# EasyEDA Pro project 校赛整流逆变一体板.epro

# Schematic buck-boost
Board Name: Board3; Create Date: 2026-04-09; Page Name: P1; Project Name: 校赛整流逆变一体板; Schematic Name: buck-boost; Update Date: 2026-04-09; Company: 嘉立创EDA; Page Size: A4; Version: V1.0
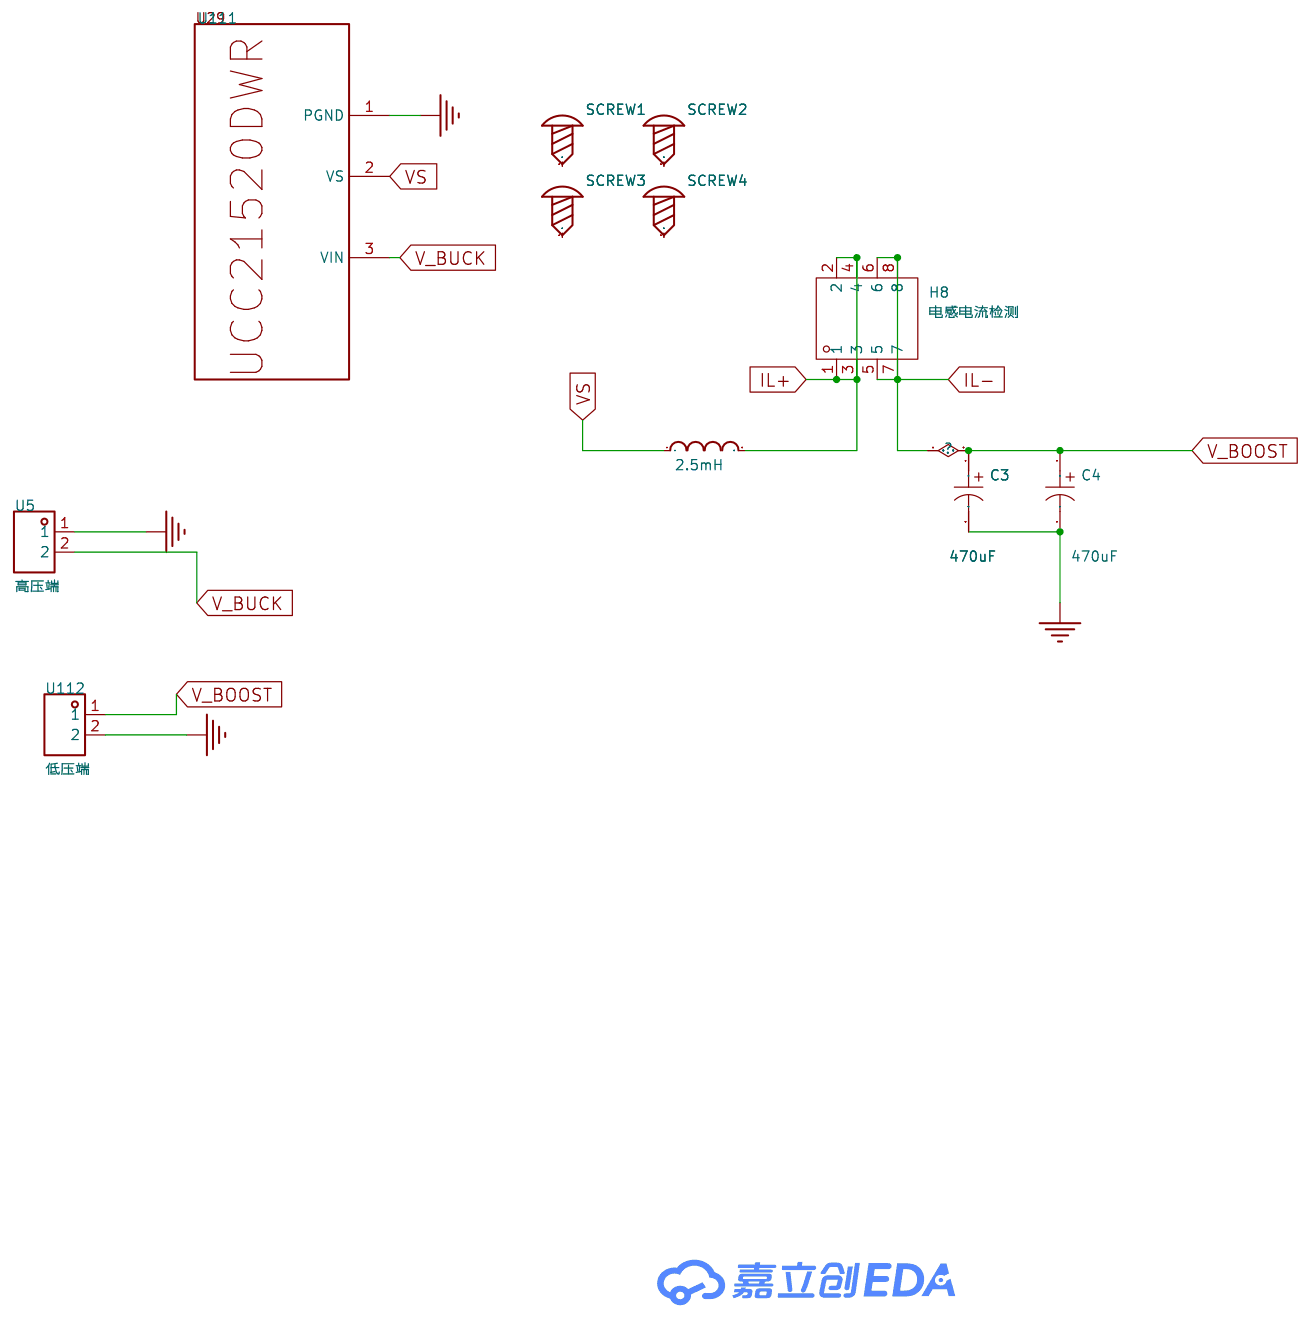
[diagram p0: schematic sheet]

## Parts
C3  470uF  [CAP-TH_BD16.0-P7.50-D0.8-FD]
C4  470uF  [CAP-TH_BD16.0-P7.50-D0.8-FD]
H8  电感电流检测  [HDR-TH_8P-P2.54-V-F-R2-C4-S2.54-1]
L2  2.5mH  [直插环形电感]
SCREW1  -  [M3螺丝]
SCREW2  -  [M3螺丝]
SCREW3  -  [M3螺丝]
SCREW4  -  [M3螺丝]
U5  高压端  [CONN-TH_2P-P7.62_L15.2-W16.7-EX4.2]
U111  -  [ucc隔离半桥]
U112  低压端  [CONN-TH_2P-P7.62_L15.2-W16.7-EX4.2]

## Library data of the parts
C3 C4 = ERG100V470M16X26: 容值:470uF;精度:±20%;额定电压:100V;纹波电流:1.62A@100kHz;; LCSC Part Name: 470uF ±20% 100V; Supplier Part: C49256827; Manufacturer: JIERR(捷而瑞); Supplier Footprint: 插件,D16xL26mm; JLCPCB Part Class: 扩展库; Datasheet: https://item.szlcsc.com/datasheet/ERG100V470M16X26/51692227.html; Supplier: LCSC; Tolerance: ±20%; Voltage Rating: 100V; Ripple Current: 1.62A@100kHz; Pin Spacing: 7.5mm; Diameter: 16mm; Height - Seated (Max): 26mm; Lifetime: 2000hrs@105℃; Operating Temperature: -40℃~+105℃
H8 = HX PM2.54-2x4P ZC: 插孔结构:2x4P;间距:2.54mm;行距:2.54mm;圆孔/方孔:方孔;安装方式:直插;排数:双排;总孔位数:8P;额定电流:3A;额定电压:1kV;插孔方向:顶部;塑高:8.5mm;触头材质:黄铜;触头镀层:金;工作温度:-40℃~+105℃;; LCSC Part Name: 2x4P 间距:2.54mm 直插; Supplier Part: C32713305; Manufacturer: hanxia(韩下); Supplier Footprint: 插件,P=2.54mm; JLCPCB Part Class: 扩展库; Datasheet: https://item.szlcsc.com/datasheet/HX%2520PM2.54-2x4P%2520ZC/34444585.html; Supplier: LCSC; Holes Structure: 2x4P; Pitch: 2.54mm; Row Spacing: 2.54mm; Circular Hole / Square Hole: 方孔; Mounting Type: 直插; Number of Rows: 双排; Number of Positions: 8P; Current Rating: 3A; Voltage Rating (Max): 1kV; Holes Direction: 顶部; Insulation Height: 8.5mm; Contact Material: 黄铜; Contact Plating: 金; Operating Temperature: -40℃~+105℃; PIN Length: 3.2mm
L2 = 直插环形电感
SCREW1-SCREW4 = M3螺丝: Supplier Footprint: 插件
U5 U112 = DBT50G-7.62-2P-BK-P: 隔板类型:带盖板;间距:7.62mm;结构:1x2P;安装方式:直针;引脚位置:边脚;排数:1;额定电流:20A;额定电压:300V;线规 - AWG:12~22;线规 - 平方毫米:-;工作温度范围:-40℃~+105℃;颜色:黑色;每排PIN数:2;; LCSC Part Name: 7.62mm 1x2P 每排P数:2 排数:1 直针 边脚; Supplier Part: C496127; Manufacturer: DORABO(地博电气); Supplier Footprint: 插件,P=7.62mm; JLCPCB Part Class: 扩展库; Datasheet: https://atta.szlcsc.com/upload/public/pdf/source/20230321/5EF6A0D07A73B1490602C5D26A4C0507.pdf; Supplier: LCSC; Barrier Type: 带盖板; Pitch: 7.62mm; Structure: 1x2P; Mounting Style: 直针; Pin Location: 边脚; Number of Pins: 2P; Number of Rows: 1; Current Rating (Max): 20A; Voltage Rating (Max): 300V; Wire Gauge - AWG: 12~22; Operating Temperature Range: -40℃~+105℃; Color: 黑色; Number of PINs Per Row: 2
U111 = UCC隔离半桥

## Nets
PGND: C3.2 C4.2 U5.1 U111.1(PGND) U112.2
IL+: H8.1 H8.2 H8.3 H8.4 L2.2
IL-: C3.1 C4.1 H8.5 H8.6 H8.7 H8.8 U112.1
V_BUCK: U5.2 U111.3(VIN)
VS: L2.1 U111.2(VS)

Not connected (* = marked no-connect by the designer): SCREW1 1; SCREW2 1; SCREW3 1; SCREW4 1

# Schematic LCL滤波
Board Name: Board2; Create Date: 2026-04-09; Page Name: P1; Project Name: 校赛整流逆变一体板; Schematic Name: LCL滤波; Update Date: 2026-04-12; Company: 嘉立创EDA; Page Size: A4; Version: V1.0
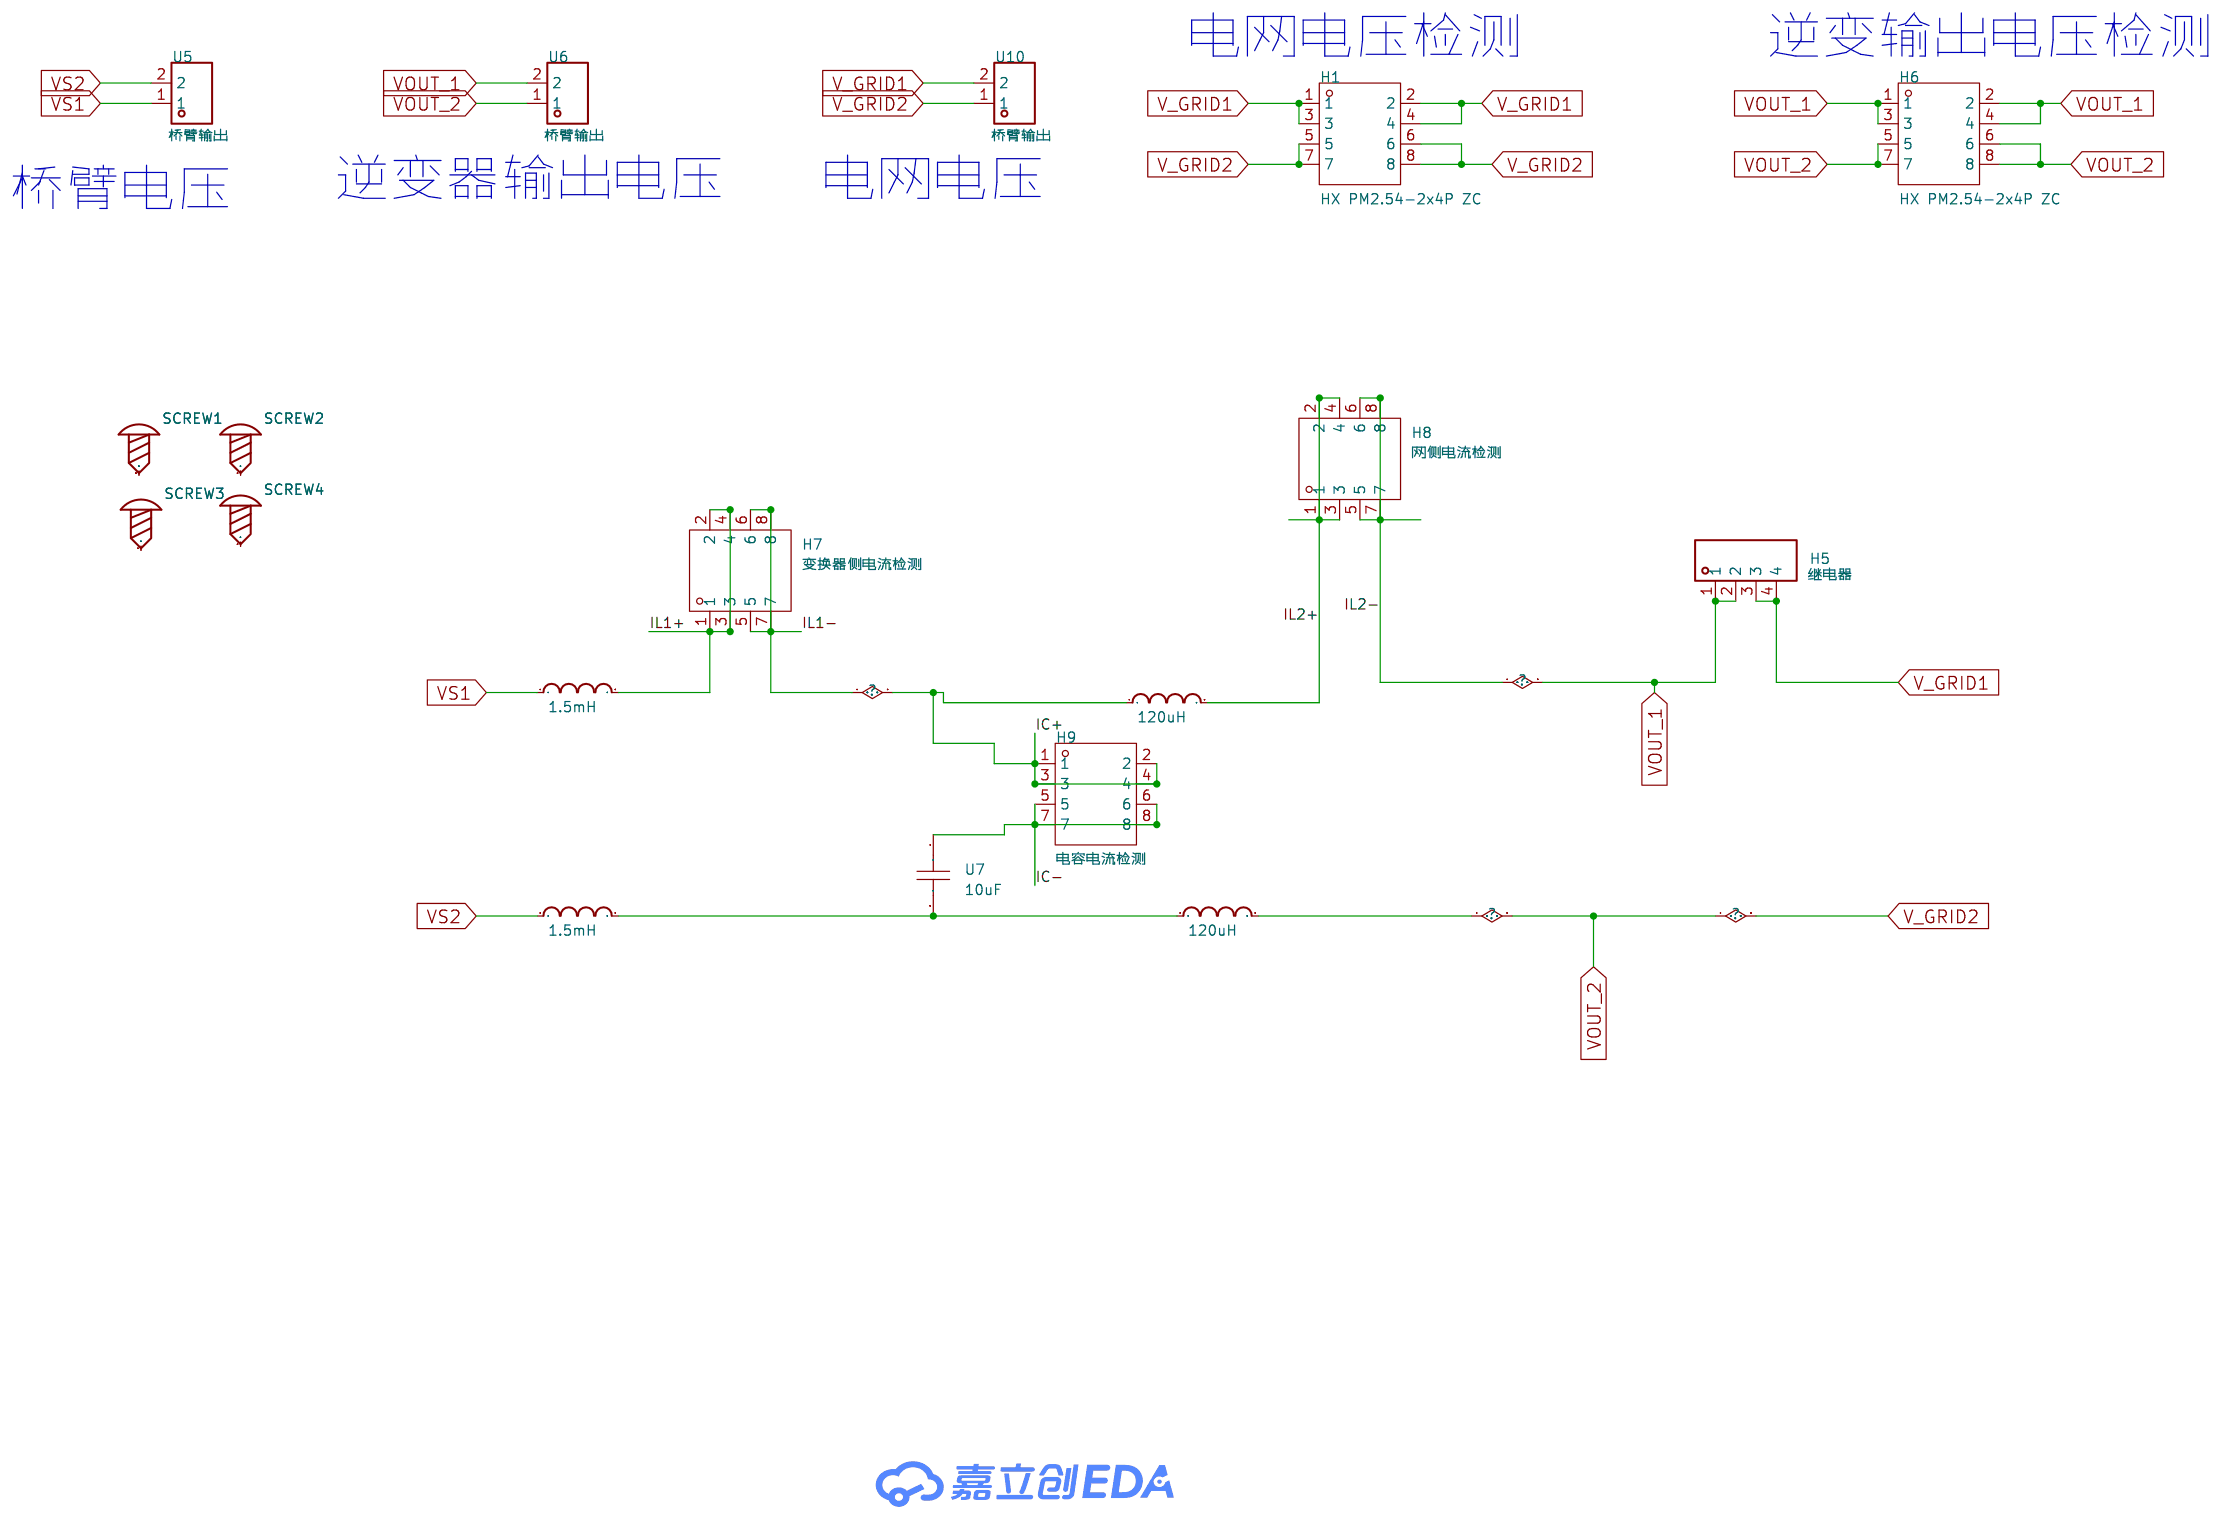
[diagram p1: schematic sheet]

## Parts
H1  HX PM2.54-2x4P ZC  [HDR-TH_8P-P2.54-V-F-R2-C4-S2.54-1]
H5  继电器  [HDR-TH_4P-P2.54-V-F]
H6  HX PM2.54-2x4P ZC  [HDR-TH_8P-P2.54-V-F-R2-C4-S2.54-1]
H7  变换器侧电流检测  [HDR-TH_8P-P2.54-V-F-R2-C4-S2.54-1]
H8  网侧电流检测  [HDR-TH_8P-P2.54-V-F-R2-C4-S2.54-1]
H9  电容电流检测  [HDR-TH_8P-P2.54-V-F-R2-C4-S2.54-1]
L1  1.5mH  [直插环形电感]
L2  120uH  [直插环形电感]
L3  1.5mH  [直插环形电感]
L4  120uH  [直插环形电感]
SCREW1  -  [M3螺丝]
SCREW2  -  [M3螺丝]
SCREW3  -  [M3螺丝]
SCREW4  -  [M3螺丝]
U5  桥臂输出  [CONN-TH_2P-P7.62_L15.2-W16.7-EX4.2]
U6  桥臂输出  [CONN-TH_2P-P7.62_L15.2-W16.7-EX4.2]
U7  10uF  [CAP-TH_L25.5-W13.0-P22.50-D1.4]
U10  桥臂输出  [CONN-TH_2P-P7.62_L15.2-W16.7-EX4.2]

## Library data of the parts
H1 H6-H9 = HX PM2.54-2x4P ZC: 插孔结构:2x4P;间距:2.54mm;行距:2.54mm;圆孔/方孔:方孔;安装方式:直插;排数:双排;总孔位数:8P;额定电流:3A;额定电压:1kV;插孔方向:顶部;塑高:8.5mm;触头材质:黄铜;触头镀层:金;工作温度:-40℃~+105℃;; LCSC Part Name: 2x4P 间距:2.54mm 直插; Supplier Part: C32713305; Manufacturer: hanxia(韩下); Supplier Footprint: 插件,P=2.54mm; JLCPCB Part Class: 扩展库; Datasheet: https://item.szlcsc.com/datasheet/HX%2520PM2.54-2x4P%2520ZC/34444585.html; Supplier: LCSC; Holes Structure: 2x4P; Pitch: 2.54mm; Row Spacing: 2.54mm; Circular Hole / Square Hole: 方孔; Mounting Type: 直插; Number of Rows: 双排; Number of Positions: 8P; Current Rating: 3A; Voltage Rating (Max): 1kV; Holes Direction: 顶部; Insulation Height: 8.5mm; Contact Material: 黄铜; Contact Plating: 金; Operating Temperature: -40℃~+105℃; PIN Length: 3.2mm
H5 = 2.54-1*4P母: 插孔结构:1x4P;间距:2.54mm;行距:-;圆孔/方孔:方孔;安装类型:直插;排数:单排;总孔位数:4P;额定电流:3A;额定电压:-;插孔方向:顶部;塑高:-;触头材质:青铜;触头镀层:-;工作温度范围:-40℃~+105℃;焊接温度(最大值):-;; LCSC Part Name: 间距:2.54mm 1x4P 直插; Supplier Part: C2718488; Manufacturer: BOOMELE(博穆精密); Supplier Footprint: 插件,P=2.54mm; Datasheet: https://atta.szlcsc.com/upload/public/pdf/source/20210301/C2718488_F4427B881E42CAA8DDB0B1C12B3A522C.pdf; Supplier: LCSC; Holes Structure: 1x4P; Pitch: 2.54mm; Circular Hole / Square Hole: 方孔; Mounting Type: 直插; Number of Rows: 单排; Number of Holes: 4P; Current Rating (Max): 3A; Holes Direction: 顶部; Contact Material: 青铜; Operating Temperature Range: -40℃~+105℃
L1-L4 = 直插环形电感
SCREW1-SCREW4 = M3螺丝: Supplier Footprint: 插件
U5 U6 U10 = DBT50G-7.62-2P-BK-P: 隔板类型:带盖板;间距:7.62mm;结构:1x2P;安装方式:直针;引脚位置:边脚;排数:1;额定电流:20A;额定电压:300V;线规 - AWG:12~22;线规 - 平方毫米:-;工作温度范围:-40℃~+105℃;颜色:黑色;每排PIN数:2;; LCSC Part Name: 7.62mm 1x2P 每排P数:2 排数:1 直针 边脚; Supplier Part: C496127; Manufacturer: DORABO(地博电气); Supplier Footprint: 插件,P=7.62mm; JLCPCB Part Class: 扩展库; Datasheet: https://atta.szlcsc.com/upload/public/pdf/source/20230321/5EF6A0D07A73B1490602C5D26A4C0507.pdf; Supplier: LCSC; Barrier Type: 带盖板; Pitch: 7.62mm; Structure: 1x2P; Mounting Style: 直针; Pin Location: 边脚; Number of Pins: 2P; Number of Rows: 1; Current Rating (Max): 20A; Voltage Rating (Max): 300V; Wire Gauge - AWG: 12~22; Operating Temperature Range: -40℃~+105℃; Color: 黑色; Number of PINs Per Row: 2
U7 = C222E106K90C000: 容值:10uF;精度:±10%;额定电压:250V;介电材料:金属化聚酯;工作温度:-55℃~+105℃;; LCSC Part Name: 10uF ±10% 250V; Supplier Part: C328801; Manufacturer: faratronic(厦门法拉); Supplier Footprint: 插件,P=22.5mm; JLCPCB Part Class: 扩展库; Datasheet: https://item.szlcsc.com/datasheet/C222E106K90C000/308648.html; Supplier: LCSC; Tolerance: ±10%; Voltage Rating: 250V; Dielectric Material: 金属化聚酯; Operating Temperature: -55℃~+105℃

## Nets
IC+: H7.5 H7.6 H7.7 H7.8 H9.1 H9.2 H9.3 H9.4 L2.1
IC-: H9.5 H9.6 H9.7 H9.8 U7.1
IL1+: H7.1 H7.2 H7.3 H7.4 L1.2
IL2+: H8.1 H8.2 H8.3 H8.4 L2.2
IL2-: H5.1 H5.2 H6.1 H6.2 H6.3 H6.4 H8.5 H8.6 H8.7 H8.8 U6.2
V_GRID1: H1.1 H1.2 H1.3 H1.4 H5.3 H5.4 U10.2
VOUT_2: H1.5 H1.6 H1.7 H1.8 H6.5 H6.6 H6.7 H6.8 L4.2 U6.1 U10.1
VS1: L1.1 U5.1
VS2: L3.1 U5.2
$1N1166: L3.2 L4.1 U7.2

Not connected (* = marked no-connect by the designer): SCREW1 1; SCREW2 1; SCREW3 1; SCREW4 1

## Notes on the sheet
- 电网电压检测
- 逆变输出电压检测
- 桥臂电压
- 逆变器输出电压
- 电网电压

# Schematic 逆变整流H桥
Board Name: Board1; Create Date: 2026-04-08; Page Name: P1; Project Name: 校赛整流逆变一体板; Schematic Name: 逆变整流H桥; Update Date: 2026-04-09; Company: 嘉立创EDA; Page Size: A4; Version: V1.0
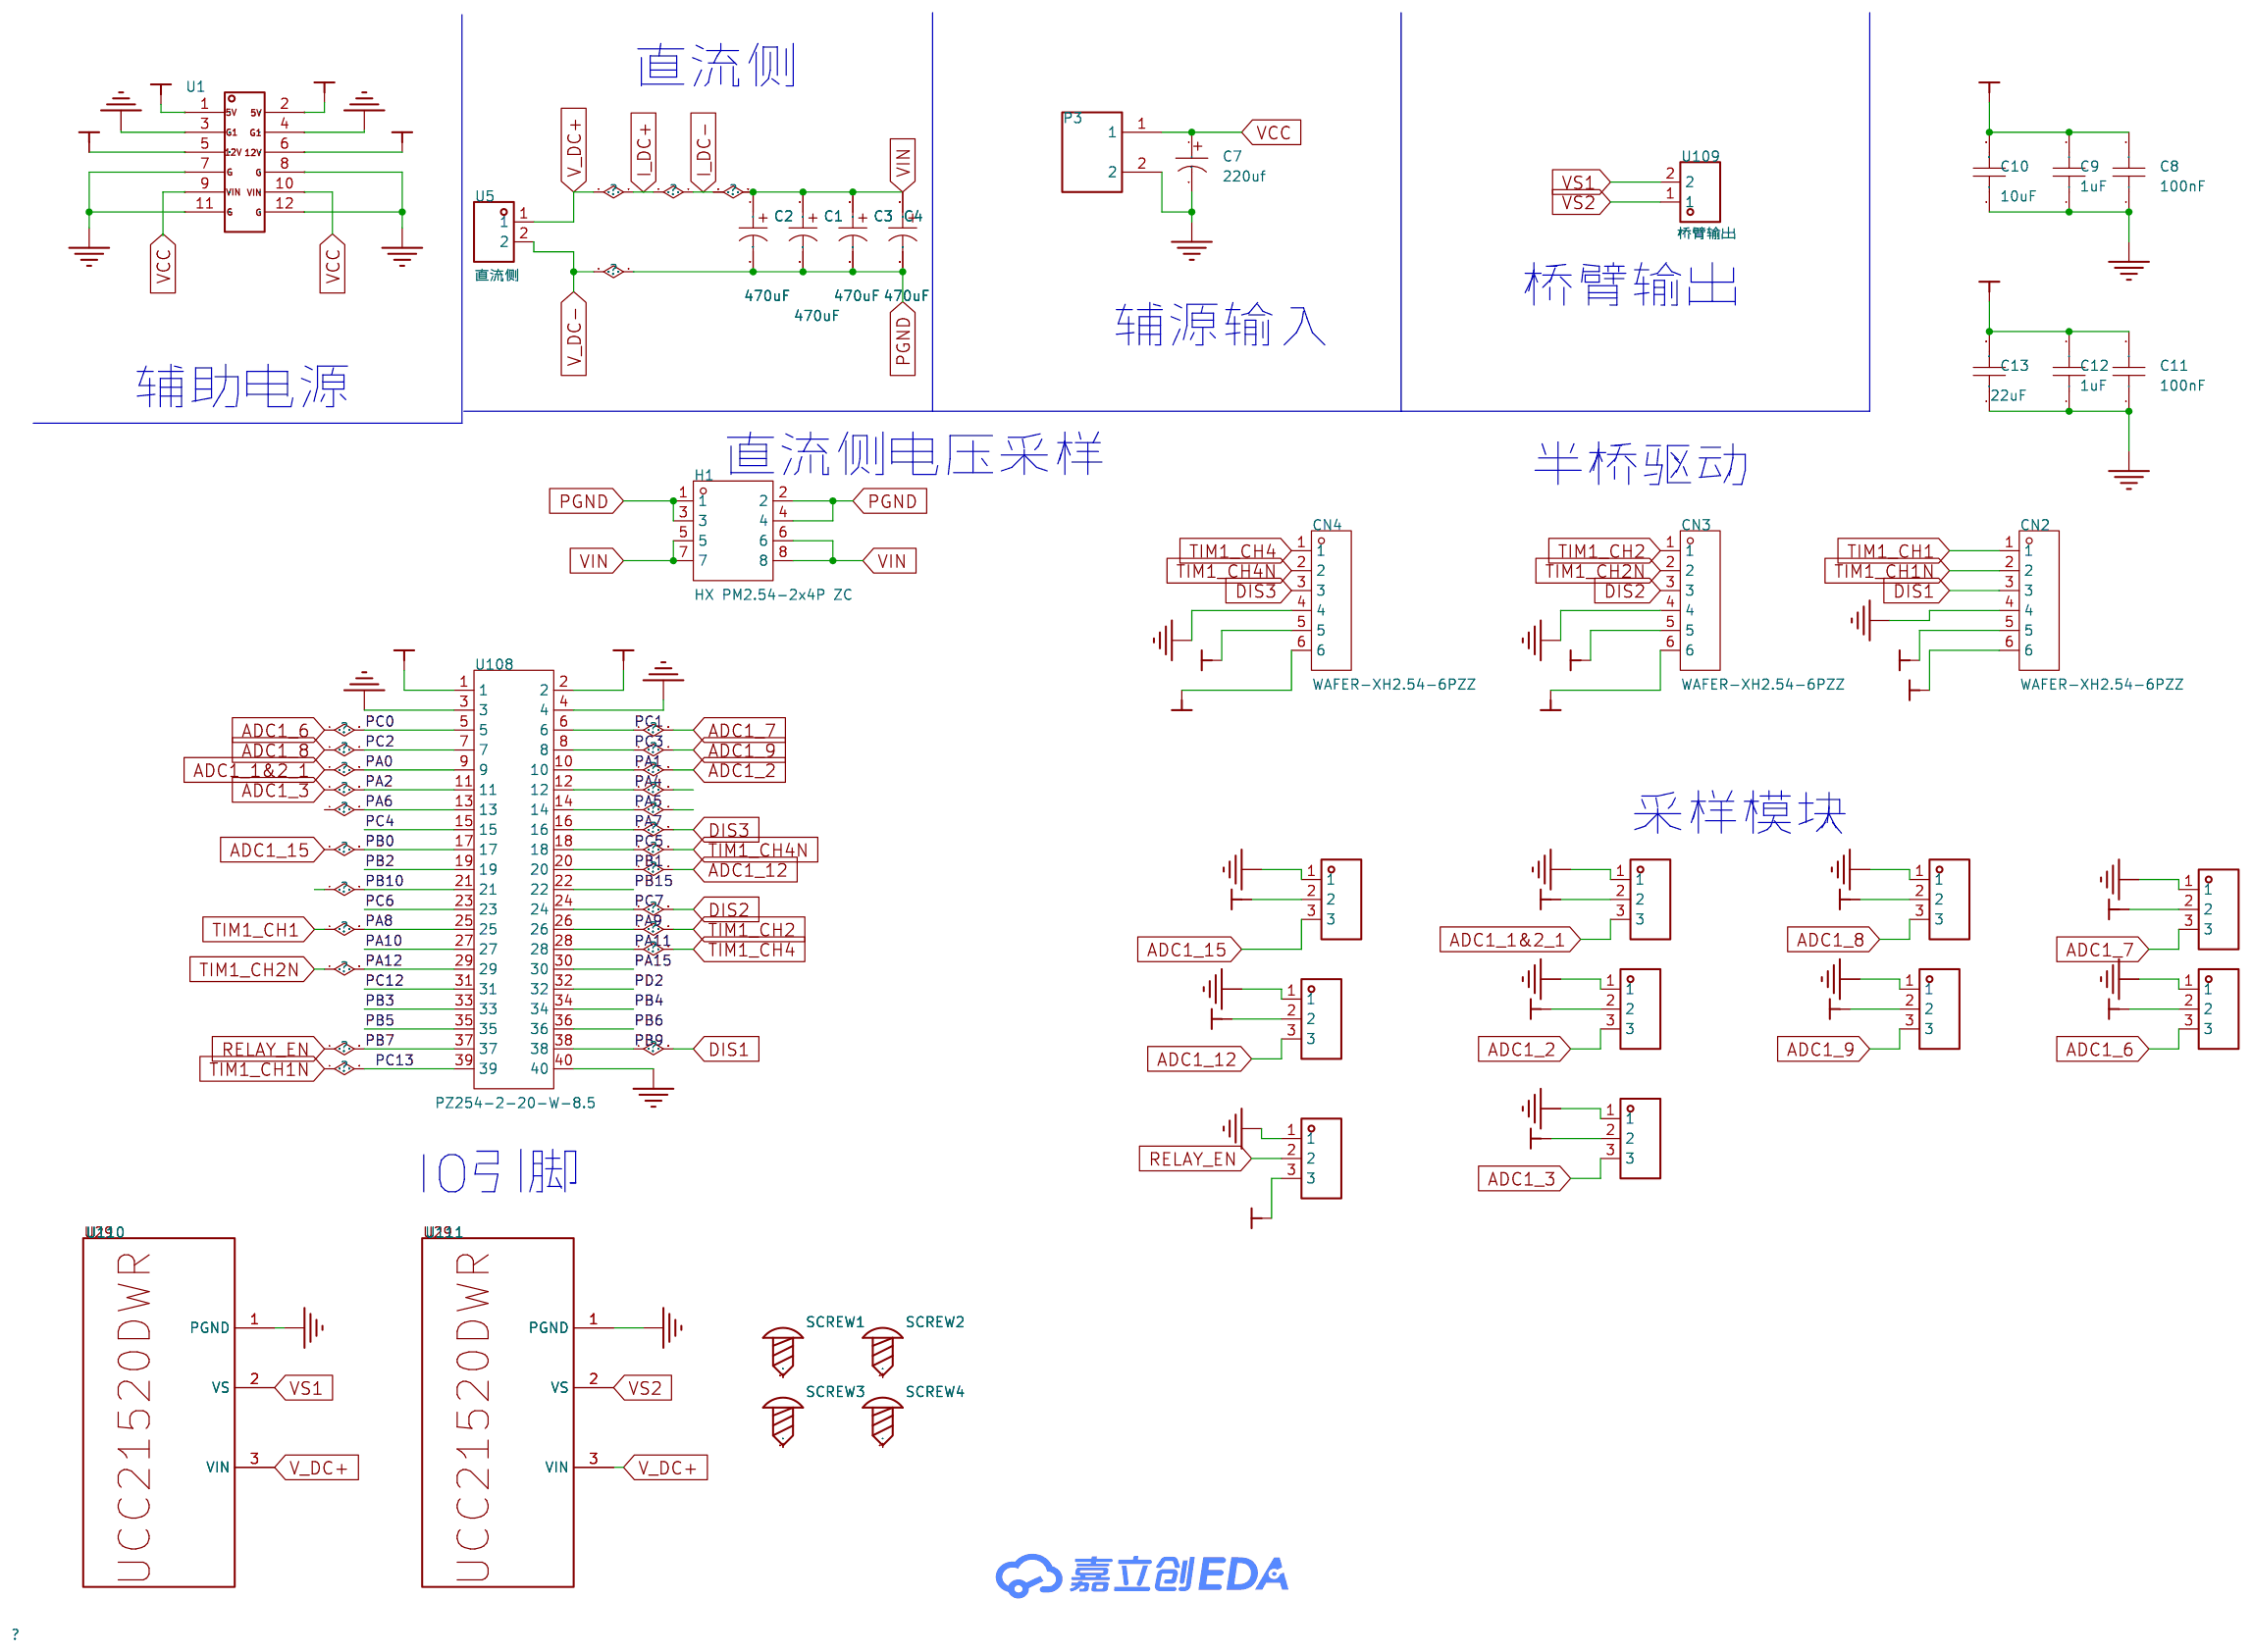
[diagram p2: schematic sheet]

## Parts
5VADC3GND2  WAFER-XH2.54-3PZZ  [CONN-TH_3P-P2.50_WAFER-XH2.54-3PZZ]
5VADC3GND3  WAFER-XH2.54-3PZZ  [CONN-TH_3P-P2.50_WAFER-XH2.54-3PZZ]
5VADC3GND4  WAFER-XH2.54-3PZZ  [CONN-TH_3P-P2.50_WAFER-XH2.54-3PZZ]
5VADC3GND5  WAFER-XH2.54-3PZZ  [CONN-TH_3P-P2.50_WAFER-XH2.54-3PZZ]
5VADC3GND6  WAFER-XH2.54-3PZZ  [CONN-TH_3P-P2.50_WAFER-XH2.54-3PZZ]
5VADC3GND7  WAFER-XH2.54-3PZZ  [CONN-TH_3P-P2.50_WAFER-XH2.54-3PZZ]
5VADC3GND8  WAFER-XH2.54-3PZZ  [CONN-TH_3P-P2.50_WAFER-XH2.54-3PZZ]
5VADC3GND9  WAFER-XH2.54-3PZZ  [CONN-TH_3P-P2.50_WAFER-XH2.54-3PZZ]
5VADC3GND10  WAFER-XH2.54-3PZZ  [CONN-TH_3P-P2.50_WAFER-XH2.54-3PZZ]
5VADC3GND11  WAFER-XH2.54-3PZZ  [CONN-TH_3P-P2.50_WAFER-XH2.54-3PZZ]
C1  470uF  [CAP-TH_BD16.0-P7.50-D0.8-FD]
C2  470uF  [CAP-TH_BD16.0-P7.50-D0.8-FD]
C3  470uF  [CAP-TH_BD16.0-P7.50-D0.8-FD]
C4  470uF  [CAP-TH_BD16.0-P7.50-D0.8-FD]
C7  220uf  [CAP-TH_BD12.5-P5.00-D0.6-FD]
C8  100nF  [C0603]
C9  1uF  [C0603]
C10  10uF  [C0603]
C11  100nF  [C0603]
C12  1uF  [C0603]
C13  22uF  [C0603]
CN2  WAFER-XH2.54-6PZZ  [CONN-TH_XH2.54-6P]
CN3  WAFER-XH2.54-6PZZ  [CONN-TH_XH2.54-6P]
CN4  WAFER-XH2.54-6PZZ  [CONN-TH_XH2.54-6P]
H1  HX PM2.54-2x4P ZC  [HDR-TH_8P-P2.54-V-F-R2-C4-S2.54-1]
P3  WJ128V-5.0-2P  [CONN-TH_2P-P5.00_WJ128V-5.0-2P]
SCREW1  -  [M3螺丝]
SCREW2  -  [M3螺丝]
SCREW3  -  [M3螺丝]
SCREW4  -  [M3螺丝]
U1  -  [辅助电源板卡-60-12-5]
U5  直流侧  [CONN-TH_2P-P7.62_L15.2-W16.7-EX4.2]
U108  PZ254-2-20-W-8.5  [HDR-TH_40P-P2.54-H-M-R2-C20-S2.54-W12.9-N]
U109  桥臂输出  [CONN-TH_2P-P7.62_L15.2-W16.7-EX4.2]
U110  -  [ucc隔离半桥]
U111  -  [ucc隔离半桥]

## Library data of the parts
5VADC3GND2-5VADC3GND11 = WAFER-XH2.54-3PZZ: 插针结构:1x3P;间距:2.54mm;安装方式:直插;总PIN数:3P;排数:1;每排PIN数:3;额定电流:2A;工作温度范围:-25℃~+85℃;; LCSC Part Name: XH 2.54mm 1x3P 直插; Supplier Part: C5374805; Manufacturer: XUNPU(讯普); Supplier Footprint: 插件,P=2.5mm; JLCPCB Part Class: 扩展库; Supplier: LCSC; Pins Structure: 1x3P; Pitch: 2.54mm; Mounting Style: 直插; Number of Pins: 3P; Number of Rows: 1; Number of PINs Per Row: 3; Current Rating (Max): 2A; Operating Temperature Range: -25℃~+85℃
C1-C4 = ERG100V470M16X26: 容值:470uF;精度:±20%;额定电压:100V;纹波电流:1.62A@100kHz;; LCSC Part Name: 470uF ±20% 100V; Supplier Part: C49256827; Manufacturer: JIERR(捷而瑞); Supplier Footprint: 插件,D16xL26mm; JLCPCB Part Class: 扩展库; Datasheet: https://item.szlcsc.com/datasheet/ERG100V470M16X26/51692227.html; Supplier: LCSC; Tolerance: ±20%; Voltage Rating: 100V; Ripple Current: 1.62A@100kHz; Pin Spacing: 7.5mm; Diameter: 16mm; Height - Seated (Max): 26mm; Lifetime: 2000hrs@105℃; Operating Temperature: -40℃~+105℃
C7 = 35YXJ1000M12.5X20: 容值:1000uF;精度:±20%;额定电压:35V;; LCSC Part Name: 1000uF ±20% 35V; Supplier Part: C88743; Manufacturer: rubycon(红宝石); Supplier Footprint: 插件,D12.5xL20mm; JLCPCB Part Class: 扩展库; Datasheet: https://atta.szlcsc.com/upload/public/pdf/source/20200113/C88743_7A9E1D91AFF2E9AFD34B160DBDD0EC66.pdf; Supplier: LCSC; Tolerance: ±20%; Rated Voltage: 35V; Lead Spacing: 5mm; φD: 12.5mm; L: 20mm; Lifetime @ Temp: 10000hrs@105℃
C8-C13 = CSA0603X7R104K101JT: 容值:100nF;精度:±10%;额定电压:100V;温度系数:X7R;; LCSC Part Name: 100nF ±10% 100V; Supplier Part: C20069879; Manufacturer: HRE(芯声); Supplier Footprint: 0603; Datasheet: https://item.szlcsc.com/datasheet/CSA0603X7R104K101JT/21398141.html; Supplier: LCSC; Tolerance: ±10%; Voltage Rating: 100V; Temperature Coefficient: X7R
CN2-CN4 = WAFER-XH2.54-6PZZ: 插针结构:1x6P;间距:2.5mm;安装方式:直插;参考系列:XH;总PIN数:6P;排数:1;每排PIN数:6;行距:-;额定电流:2A;触头材质:黄铜;触头镀层:锡;工作温度:-25℃~+85℃;; LCSC Part Name: 1x6P 间距:2.5mm 直插 系列:XH; Supplier Part: C5359634; Manufacturer: XUNPU(讯普); Supplier Footprint: 插件,P=2.5mm; JLCPCB Part Class: 扩展库; Datasheet: https://atta.szlcsc.com/upload/public/pdf/source/20230221/5D6483F9C7001DB87CFCFC787E1DC139.pdf; Supplier: LCSC; Pins Structure: 1x6P; Pitch: 2.5mm; Mounting Type: 直插; Reference Series: XH; Number of Pins: 6P; Number of Rows: 1; Number of PINs Per Row: 6; Current Rating: 2A; Contact Material: 黄铜; Contact Plating: 锡; Operating Temperature: -25℃~+85℃; Voltage Rating: 250V; Plastic Material: PA66; Flame Retardant Rating: UL94V-0; Color: 白色; Z-Height of the Board: 7mm; X-Length of Bottom Edge on Board (Spacing Line): 17.5mm; Y-Width of Bottom Edge on Board: 5.9mm
H1 = HX PM2.54-2x4P ZC: 插孔结构:2x4P;间距:2.54mm;行距:2.54mm;圆孔/方孔:方孔;安装方式:直插;排数:双排;总孔位数:8P;额定电流:3A;额定电压:1kV;插孔方向:顶部;塑高:8.5mm;触头材质:黄铜;触头镀层:金;工作温度:-40℃~+105℃;; LCSC Part Name: 2x4P 间距:2.54mm 直插; Supplier Part: C32713305; Manufacturer: hanxia(韩下); Supplier Footprint: 插件,P=2.54mm; JLCPCB Part Class: 扩展库; Datasheet: https://item.szlcsc.com/datasheet/HX%2520PM2.54-2x4P%2520ZC/34444585.html; Supplier: LCSC; Holes Structure: 2x4P; Pitch: 2.54mm; Row Spacing: 2.54mm; Circular Hole / Square Hole: 方孔; Mounting Type: 直插; Number of Rows: 双排; Number of Positions: 8P; Current Rating: 3A; Voltage Rating (Max): 1kV; Holes Direction: 顶部; Insulation Height: 8.5mm; Contact Material: 黄铜; Contact Plating: 金; Operating Temperature: -40℃~+105℃; PIN Length: 3.2mm
P3 = WJ128V-5.0-2P: 结构:1x2P;间距:5mm;颜色:绿色;安装方式:直插;额定电流:20A;额定电压:250V;排数:1;线规 - AWG:12~22;线规 - 平方毫米:2.5;每排PIN数:2;工作温度范围:-40℃~+105℃;; LCSC Part Name: 5mm 1x2P 排数:1 每排P数:2 直插; Supplier Part: C8269; Manufacturer: KANGNEX(康奈克斯电气); Supplier Footprint: 插件,P=5mm; JLCPCB Part Class: 扩展库; Datasheet: https://atta.szlcsc.com/upload/public/pdf/source/20191225/C8269_1FF44D6D2E83DB14A7CA266A410FD9AD.pdf; Supplier: LCSC; Structure: 1x2P; Pitch: 5mm; Color: 绿色; Mounting Style: 直插; Current Rating (Max): 20A; Voltage Rating (Max): 250V; Number of Pins: 2P; Number of Rows: 1; Wire Gauge - AWG: 12~22; Wire Gauge - mm2: 2.5; Number of PINs Per Row: 2; Operating Temperature Range: -40℃~+105℃
SCREW1-SCREW4 = M3螺丝: Supplier Footprint: 插件
U1 = 辅助电源板卡-60-12-5
U5 U109 = DBT50G-7.62-2P-BK-P: 隔板类型:带盖板;间距:7.62mm;结构:1x2P;安装方式:直针;引脚位置:边脚;排数:1;额定电流:20A;额定电压:300V;线规 - AWG:12~22;线规 - 平方毫米:-;工作温度范围:-40℃~+105℃;颜色:黑色;每排PIN数:2;; LCSC Part Name: 7.62mm 1x2P 每排P数:2 排数:1 直针 边脚; Supplier Part: C496127; Manufacturer: DORABO(地博电气); Supplier Footprint: 插件,P=7.62mm; JLCPCB Part Class: 扩展库; Datasheet: https://atta.szlcsc.com/upload/public/pdf/source/20230321/5EF6A0D07A73B1490602C5D26A4C0507.pdf; Supplier: LCSC; Barrier Type: 带盖板; Pitch: 7.62mm; Structure: 1x2P; Mounting Style: 直针; Pin Location: 边脚; Number of Pins: 2P; Number of Rows: 1; Current Rating (Max): 20A; Voltage Rating (Max): 300V; Wire Gauge - AWG: 12~22; Operating Temperature Range: -40℃~+105℃; Color: 黑色; Number of PINs Per Row: 2
U108 = PZ254-2-20-W-8.5: 插针结构:2x20P;间距:2.54mm;行距:2.54mm;圆针/方针:方针;安装方式:弯插;排数:双排;总PIN位数:40P;额定电流:3A;额定电压:-;配合针长度:6mm;塑高:2.5mm;端接针长度:-;触头材质:黄铜;工作温度:-40℃~+105℃;颜色:黑色;; LCSC Part Name: 2x20P 间距:2.54mm 方针 弯插; Supplier Part: C3012279; Manufacturer: HCTL(华灿天禄); Supplier Footprint: 弯插,P=2.54mm; JLCPCB Part Class: 扩展库; Datasheet: https://atta.szlcsc.com/upload/public/pdf/source/20230609/1B60364E488FD8696AA7206A46578DEA.pdf; Supplier: LCSC; Pin Structure: 2x20P; Pitch: 2.54mm; Row Spacing: 2.54mm; Circluar Pins/Square Pins: 方针; Mounting Type: 弯插; Number of Rows: 双排; Number of Pins: 40P; Current Rating: 3A; Length of Mating Pin: 6mm; Insulation Height: 2.5mm; Contact Material: 黄铜; Operating Temperature: -40℃~+105℃; Color: 黑色
U110 U111 = UCC隔离半桥

## Nets
5V: 5VADC3GND2.2 5VADC3GND3.2 5VADC3GND4.2 5VADC3GND5.2 5VADC3GND6.2 5VADC3GND7.2 5VADC3GND8.2 5VADC3GND9.2 5VADC3GND10.3 5VADC3GND11.2 C8.2 C9.2 C10.2 CN2.5 CN3.5 CN4.5 U1.1 U1.2 U108.1 U108.2
12V: C11.2 C12.2 C13.2 CN2.6 CN3.6 CN4.6 U1.5 U1.6
AGND: 5VADC3GND2.1 5VADC3GND3.1 5VADC3GND4.1 5VADC3GND5.1 5VADC3GND6.1 5VADC3GND7.1 5VADC3GND8.1 5VADC3GND9.1 5VADC3GND10.1 5VADC3GND11.1 C8.1 C9.1 C10.1 C11.1 C12.1 C13.1 CN2.4 CN3.4 CN4.4 U1.3 U1.4 U108.3 U108.4 U108.40
PGND: C1.2 C2.2 C3.2 C4.2 C7.2 H1.1 H1.2 H1.3 H1.4 P3.2 U1.7 U1.8 U1.11 U1.12 U5.2 U110.1(PGND) U111.1(PGND)
VCC: C7.1 P3.1 U1.9 U1.10
ADC1_1&2_1: 5VADC3GND4.3 U108.9
ADC1_2: 5VADC3GND7.3 U108.10
ADC1_3: 5VADC3GND11.3 U108.11
ADC1_6: 5VADC3GND9.3 U108.5
ADC1_7: 5VADC3GND2.3 U108.6
ADC1_8: 5VADC3GND3.3 U108.7
ADC1_9: 5VADC3GND8.3 U108.8
ADC1_12: 5VADC3GND6.3 U108.20
ADC1_15: 5VADC3GND5.3 U108.17
DIS1: CN2.3 U108.38
DIS2: CN3.3 U108.24
DIS3: CN4.3 U108.16
I_DC+: C1.1 C2.1 C3.1 C4.1 H1.5 H1.6 H1.7 H1.8 U5.1 U110.3(VIN) U111.3(VIN)
PA4: U108.12
PA5: U108.14
PA6: U108.13
PA8: CN2.1 U108.25
PA9: CN3.1 U108.26
PA10: U108.27
PA11: CN4.1 U108.28
PA12: CN3.2 U108.29
PA15: U108.30
PB2: U108.19
PB3: U108.33
PB4: U108.34
PB5: U108.35
PB6: U108.36
PB7: 5VADC3GND10.2 U108.37
PB10: U108.21
PB15: U108.22
PC4: U108.15
PC5: CN4.2 U108.18
PC6: U108.23
PC12: U108.31
PC13: CN2.2 U108.39
PD2: U108.32
VS1: U109.2 U110.2(VS)
VS2: U109.1 U111.2(VS)

Not connected (* = marked no-connect by the designer): SCREW1 1; SCREW2 1; SCREW3 1; SCREW4 1

## Notes on the sheet
- 直流侧
- 桥臂输出
- 辅源输入
- 辅助电源
- 直流侧电压采样
- 半桥驱动
- 采样模块
- IO引脚

# Board PCB2
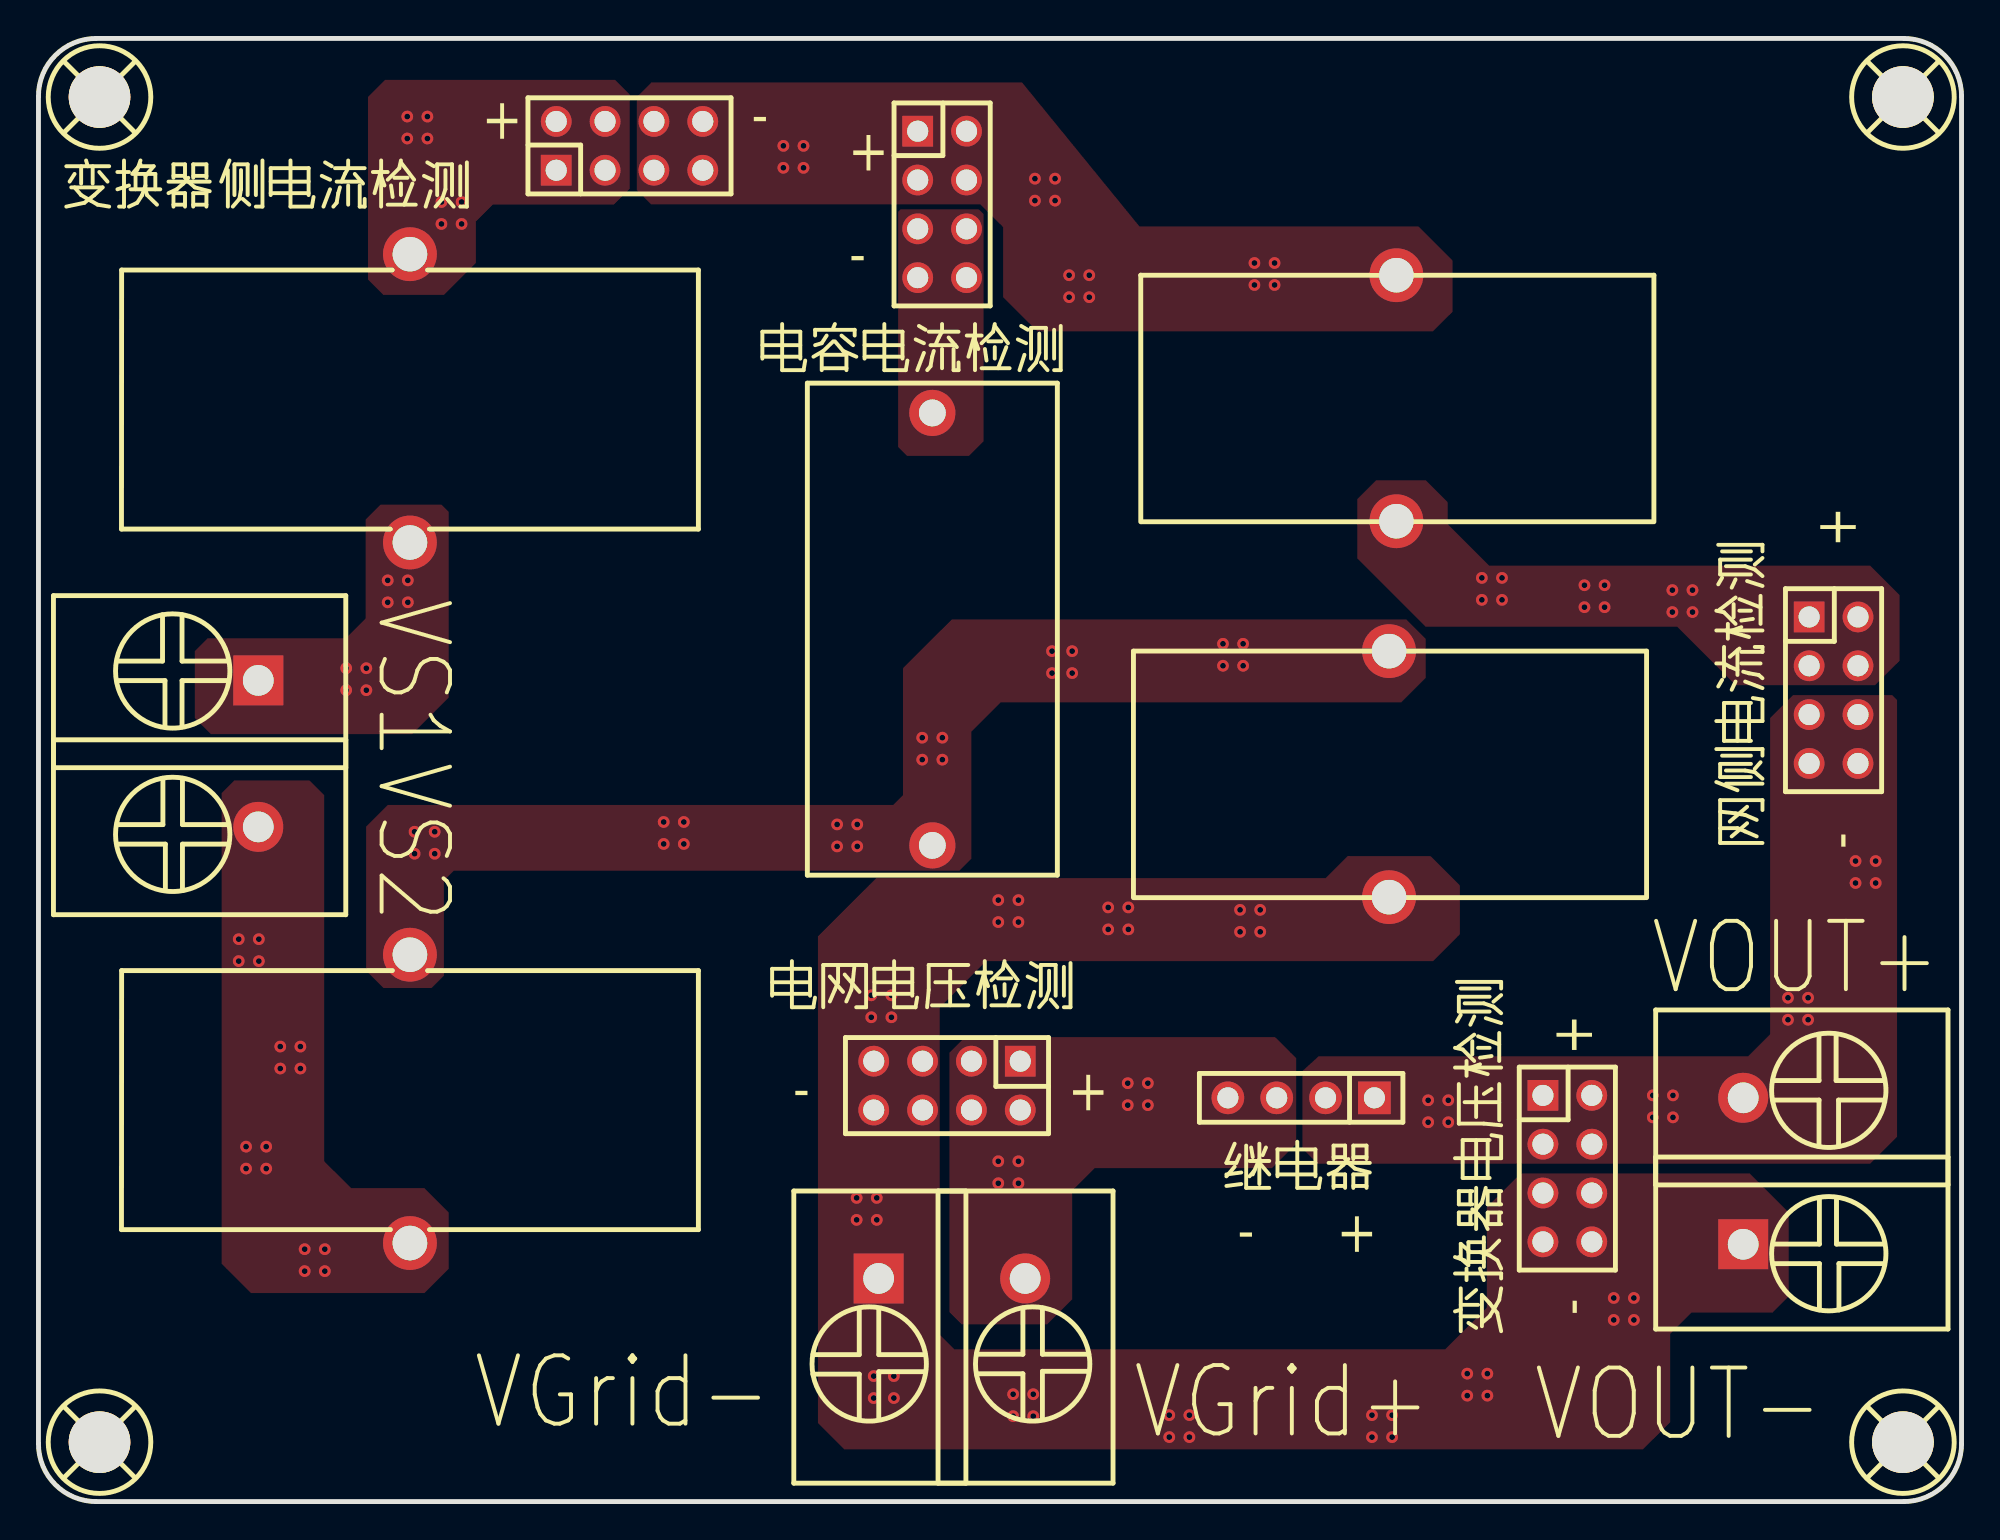
[diagram p3: board, top side]
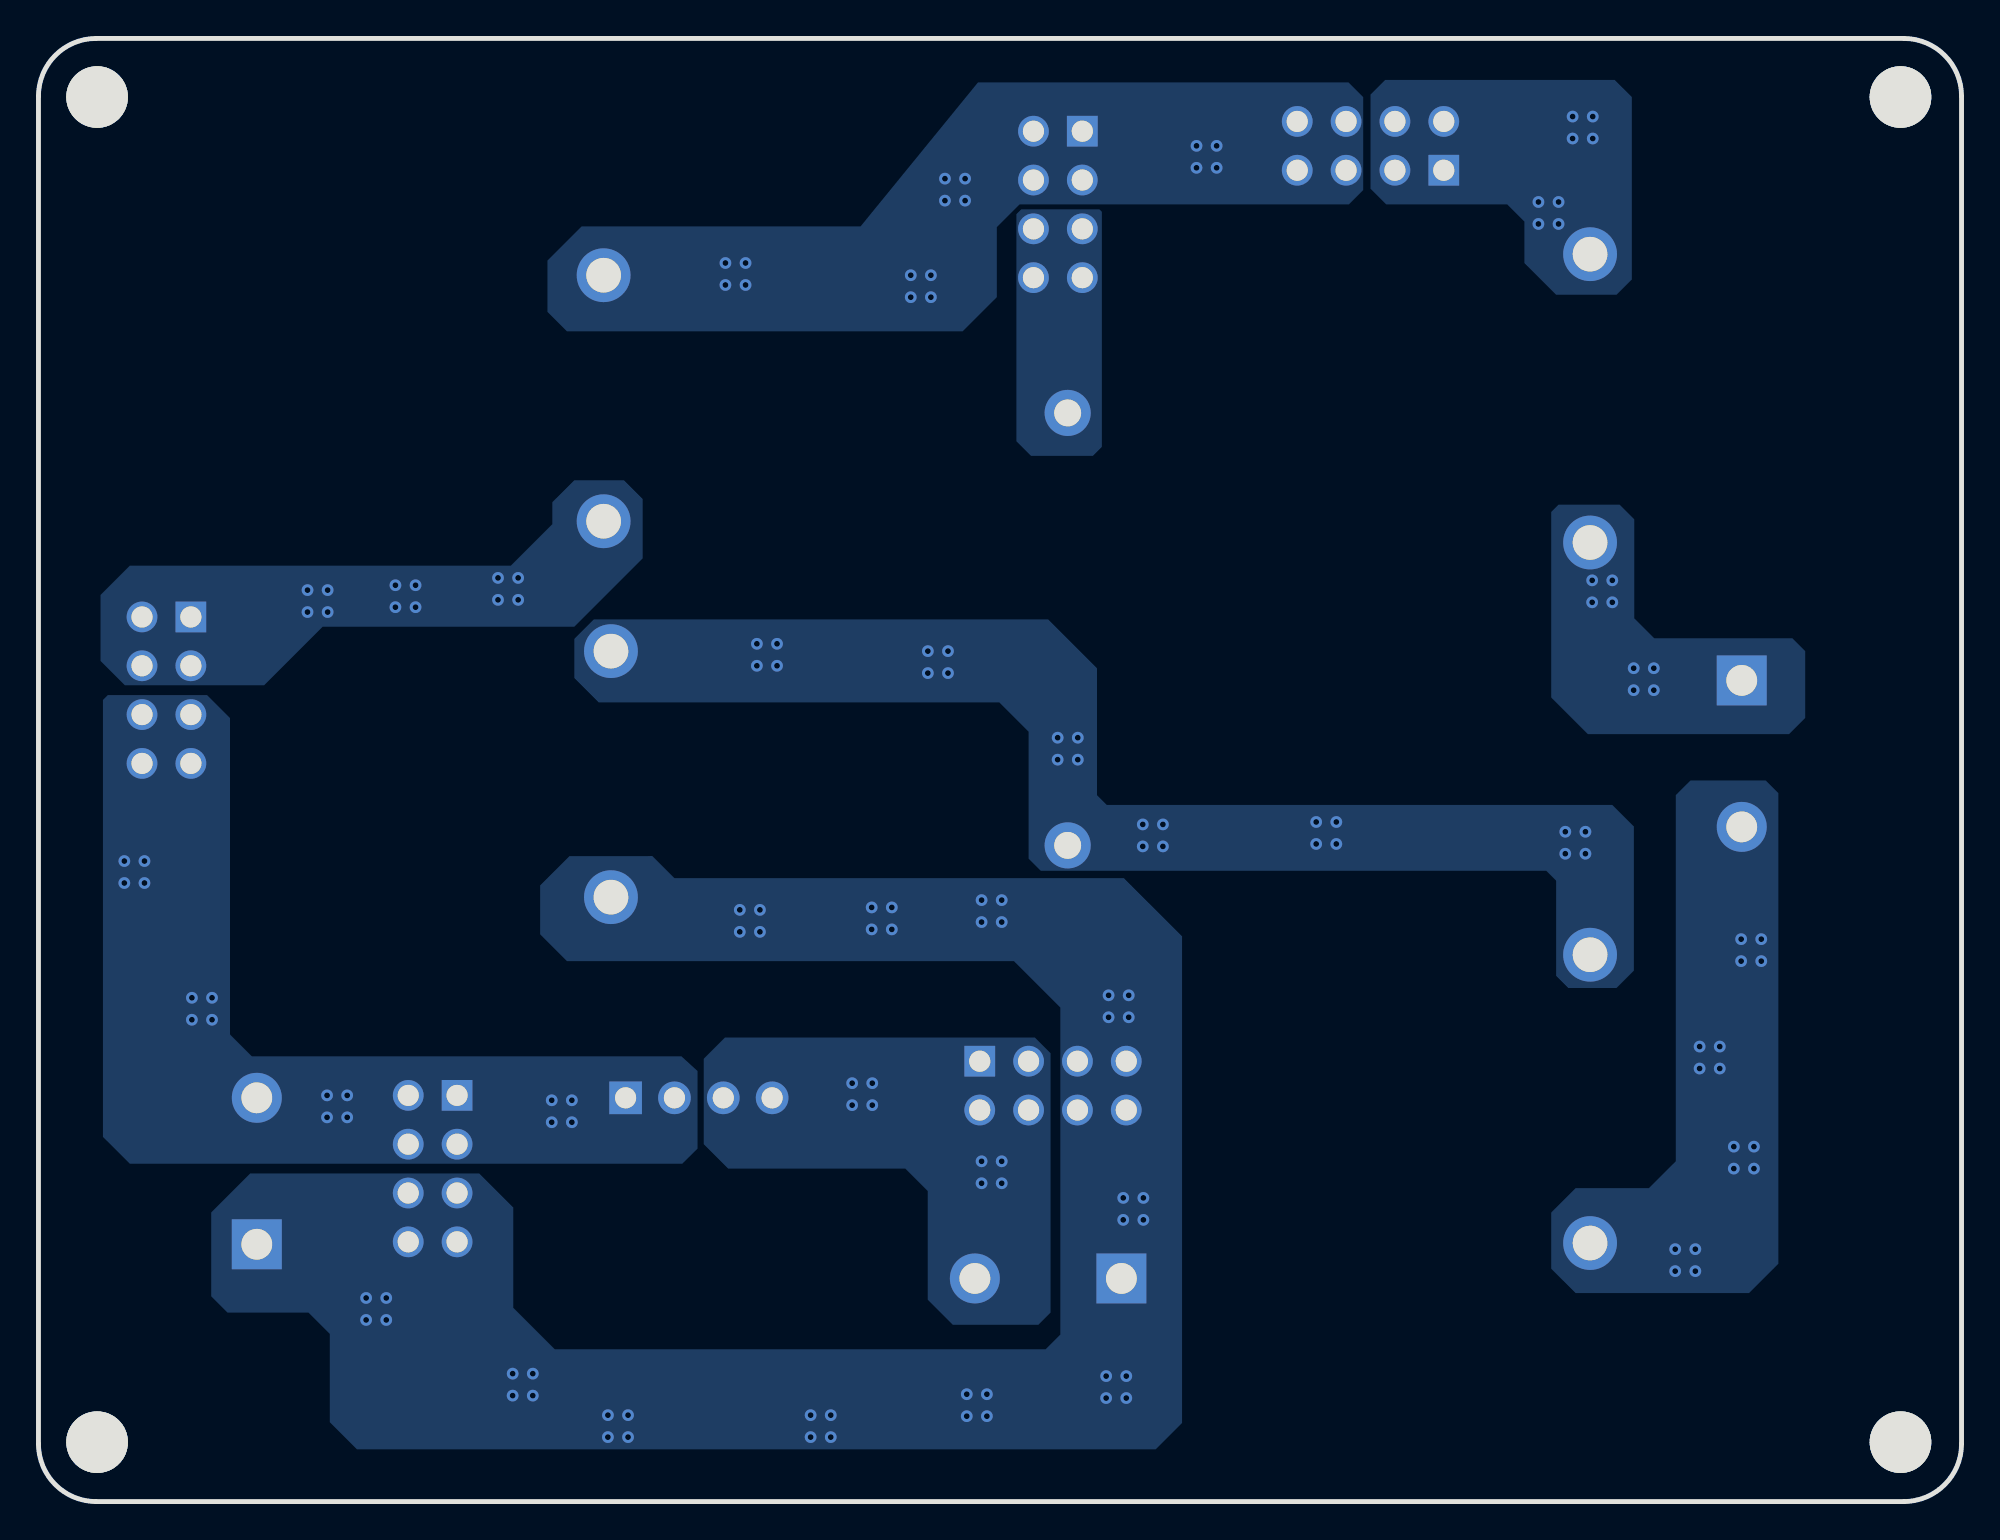
[diagram p4: board, bottom side, seen from below]

Outline 100 x 76.12 mm; copper layers: Top Layer, Bottom Layer. Coordinates in mm from the lower left corner of the outline.
Outline path: 0,73.12 0,3 arc(0.88,0.88) 3,0 97,0 arc(99.12,0.88) 100,3 100,73.12 arc(99.12,75.25) 97,76.12 3,76.12 arc(0.88,75.25) 0,73.12
Stack: Top Layer 0.035mm / Dielectric1 1.51mm FR4 er 4.5 / Bottom Layer 0.035mm

## Design rules (mm)
template: JLCPCB Capability(Two Layers Board)
spacing copperThickness1oz (default): track to track 0.102, other pairs 0.152 to 0.3
spacing copperThickness2oz: track to track 0.203, other pairs 0.152 to 0.3
track width copperThickness1oz (default): min 0.127, default 0.254, max 2.54
track width copperThickness2oz: min 0.203, default 0.254, max 2.54
differential pair differentialPair (default): width min 0.127, default 0.254, max 2.54; gap min 0.152, default 0.152
via viaSize (default): diameter min 0.5, default 0.61, max 10; hole min 0.3, default 0.305, max 6.3

## Placement (name value [footprint] x y rotation side)
H1  HX PM2.54-2x4P ZC  [HDR-TH_8P-P2.54-V-F-R2-C4-S2.54-1]  47.24 21.64 180 top
H5  继电器  [HDR-TH_4P-P2.54-V-F]  65.66 21.01 180 top
H6  HX PM2.54-2x4P ZC  [HDR-TH_8P-P2.54-V-F-R2-C4-S2.54-1]  79.5 17.32 270 top
H7  变换器侧电流检测  [HDR-TH_8P-P2.54-V-F-R2-C4-S2.54-1]  30.73 70.54 0 top
H8  网侧电流检测  [HDR-TH_8P-P2.54-V-F-R2-C4-S2.54-1]  93.34 42.21 270 top
H9  电容电流检测  [HDR-TH_8P-P2.54-V-F-R2-C4-S2.54-1]  46.99 67.49 270 top
L1  1.5mH  [直插环形电感#2]  17.27 56.44 90 top
L2  120uH  [直插环形电感]  70.61 63.8 270 top
L3  1.5mH  [直插环形电感#2]  17.27 19.99 90 top
L4  120uH  [直插环形电感]  70.23 44.25 270 top
SCREW1  -  [M3螺丝]  3.17 73.08 0 top
SCREW2  -  [M3螺丝]  96.95 73.08 0 top
SCREW3  -  [M3螺丝]  3.17 3.09 0 top
SCREW4  -  [M3螺丝]  96.95 3.09 0 top
U5  桥臂输出  [CONN-TH_2P-P7.62_L15.2-W16.7-EX4.2]  11.43 38.91 270 top
U6  桥臂输出  [CONN-TH_2P-P7.62_L15.2-W16.7-EX4.2]  88.65 17.2 90 top
U7  10uF  [CAP-TH_L25.5-W13.0-P22.50-D1.4]  46.48 45.39 270 top
U10  桥臂输出  [CONN-TH_2P-P7.62_L15.2-W16.7-EX4.2]  47.5 11.61 0 top

## Footprints (pads in the part's own frame, mm; a bottom-side part is the same pattern mirrored in y, then rotated)
CAP-TH_L25.5-W13.0-P22.50-D1.4
  round 2.4 hole 1.4: 1(-11.25,0) 2(11.25,0)
CONN-TH_2P-P7.62_L15.2-W16.7-EX4.2
  rect 2.6x2.6 hole 1.6: 1(-3.81,0)
  round 2.6 hole 1.6: 2(3.81,0)
HDR-TH_4P-P2.54-V-F
  rect 1.7x1.7 hole 1.1: 1(-3.81,0)
  round 1.7 hole 1.1: 2(-1.27,0) 3(1.27,0) 4(3.81,0)
HDR-TH_8P-P2.54-V-F-R2-C4-S2.54-1
  rect 1.6x1.6 hole 1.1: 1(-3.81,-1.27)
  round 1.6 hole 1.1: 2(-3.81,1.27) 3(-1.27,-1.27) 4(-1.27,1.27) 5(1.27,-1.27) 6(1.27,1.27) 7(3.81,-1.27) 8(3.81,1.27)
M3螺丝
  round 3.2 hole 3.2: 1(0,0)
直插环形电感
  round 2.8 hole 1.8: 1(0,0) 2(12.8,0)
直插环形电感#2
  round 2.8 hole 1.8: 1(-6.54,-2.045) 2(8.46,-2.045)

## Nets
As in the schematic.

Pads without a net: SCREW1 1; SCREW2 1; SCREW3 1; SCREW4 1

## Via types
v1: diameter 0.61, hole 0.305, Top Layer to Bottom Layer, 152 vias

## Routing (per net, layer and track width the routed paths; a pad name or vN(x,y) marks a point on that pad's centre or on a via; arc(x,y) is an arc through that point)
IC+:
  vias: v1(38.73,70.54) v1(38.73,69.39) v1(39.78,70.54) v1(39.78,69.39) v1(51.82,68.83) v1(51.82,67.69) v1(52.86,68.83) v1(52.86,67.69) v1(53.59,63.8) v1(53.59,62.66) v1(54.64,63.8) v1(54.64,62.66) v1(63.23,64.44) v1(63.23,63.3) v1(64.28,64.44) v1(64.28,63.3)
IL1+:
  vias: v1(19.18,72.06) v1(19.18,70.92) v1(20.22,72.06) v1(20.22,70.92) v1(20.95,67.61) v1(20.95,66.47) v1(22,67.61) v1(22,66.47)
IL2+:
  vias: v1(75.06,48.06) v1(75.06,46.91) v1(76.1,48.06) v1(76.1,46.91) v1(80.39,47.68) v1(80.39,46.53) v1(81.44,47.68) v1(81.44,46.53) v1(84.96,47.42) v1(84.96,46.28) v1(86.01,47.42) v1(86.01,46.28)
IL2-:
  vias: v1(72.26,20.88) v1(72.26,19.74) v1(73.31,20.88) v1(73.31,19.74) v1(83.95,21.13) v1(83.95,19.99) v1(84.99,21.13) v1(84.99,19.99) v1(90.98,26.21) v1(90.98,25.07) v1(92.02,26.21) v1(92.02,25.07) v1(94.49,33.32) v1(94.49,32.18) v1(95.53,33.32) v1(95.54,32.18)
V_GRID1:
  vias: v1(49.91,17.7) v1(49.91,16.56) v1(50.96,17.7) v1(50.96,16.56) v1(56.64,21.77) v1(56.64,20.62) v1(57.69,21.77) v1(57.69,20.62)
VOUT_2:
  vias: v1(42.55,15.8) v1(42.55,14.66) v1(43.31,26.34) v1(43.31,25.2) v1(43.43,6.53) v1(43.43,5.38) v1(43.59,15.8) v1(43.59,14.66) v1(44.35,26.34) v1(44.35,25.2) v1(44.48,6.53) v1(44.48,5.38) v1(49.91,31.29) v1(49.91,30.15) v1(50.68,5.59) v1(50.68,4.44) v1(50.96,31.29) v1(50.96,30.15) v1(51.73,5.59) v1(51.73,4.44) v1(55.63,30.91) v1(55.63,29.77) v1(56.67,30.91) v1(56.67,29.77) v1(58.8,4.5) v1(58.8,3.35) v1(59.85,4.5) v1(59.85,3.35) v1(62.48,30.78) v1(62.48,29.64) v1(63.53,30.78) v1(63.53,29.64) v1(69.34,4.5) v1(69.34,3.35) v1(70.39,4.5) v1(70.39,3.35) v1(74.3,6.66) v1(74.3,5.51) v1(75.34,6.66) v1(75.34,5.51) v1(81.92,10.59) v1(81.92,9.45) v1(82.96,10.59) v1(82.96,9.45)
VS1:
  vias: v1(16,43.36) v1(16,42.21) v1(17.05,43.36) v1(17.05,42.21) v1(18.16,47.93) v1(18.16,46.79) v1(19.21,47.93) v1(19.21,46.79)
VS2:
  vias: v1(10.41,29.26) v1(10.41,28.12) v1(10.8,18.47) v1(10.8,17.32) v1(11.46,29.26) v1(11.46,28.12) v1(11.84,18.47) v1(11.84,17.32) v1(12.57,23.67) v1(12.57,22.53) v1(13.62,23.67) v1(13.62,22.53) v1(13.84,13.13) v1(13.84,11.99) v1(14.89,13.13) v1(14.89,11.99)
$1N1166:
  vias: v1(19.56,34.85) v1(19.56,33.71) v1(20.6,34.85) v1(20.61,33.71) v1(32.51,35.36) v1(32.51,34.21) v1(33.56,35.36) v1(33.56,34.21) v1(41.53,35.23) v1(41.53,34.09) v1(42.58,35.23) v1(42.58,34.09) v1(45.96,39.74) v1(45.96,38.6) v1(47,39.74) v1(47,38.6) v1(52.7,44.25) v1(52.7,43.1) v1(53.75,44.25) v1(53.75,43.1) v1(61.59,44.63) v1(61.59,43.48) v1(62.64,44.63) v1(62.64,43.48)

## Copper pours and planes (outline as drawn; the poured copper is in the pictures)
IC+ on Top Layer: 31.11,73.84 73.53,73.84 73.53,60.88 31.11,60.88
IC+ on Bottom Layer: 31.11,73.84 73.53,73.84 73.53,60.88 31.11,60.88
IC- on Top Layer: 44.7,67.23 49.15,67.23 49.15,54.41 44.7,54.41
IC- on Bottom Layer: 44.7,67.23 49.15,67.23 49.15,54.41 44.7,54.41
IL1+ on Top Layer: 17.14,73.96 30.73,73.96 30.73,62.79 17.14,62.79
IL1+ on Top Layer: 17.14,73.96 30.73,73.96 30.73,62.79 17.14,62.79
IL1+ on Bottom Layer: 17.14,73.96 30.73,73.96 30.73,62.79 17.14,62.79
IL2+ on Top Layer: 68.58,53.14 96.77,53.14 96.77,42.47 68.58,42.47
IL2+ on Bottom Layer: 68.58,53.14 96.77,53.14 96.77,42.47 68.58,42.47
IL2- on Top Layer: 65.73,41.96 96.65,41.96 96.65,17.58 65.73,17.58
IL2- on Bottom Layer: 65.73,41.96 96.65,41.96 96.65,17.58 65.73,17.58
V_GRID1 on Top Layer: 47.37,24.17 65.4,24.17 65.4,9.22 47.37,9.22
V_GRID1 on Bottom Layer: 47.37,24.14 65.4,24.14 65.4,9.19 47.37,9.19
VOUT_2 on Top Layer: 40.53,33.59 91.02,33.59 91.02,2.72 40.53,2.72
VOUT_2 on Bottom Layer: 40.53,33.59 91.02,33.59 91.02,2.72 40.53,2.72
VS1 on Top Layer: 8.13,51.87 21.34,51.87 21.34,39.93 8.13,39.93
VS1 on Bottom Layer: 8.13,51.87 21.34,51.87 21.34,39.93 8.13,39.93
VS2 on Top Layer: 9.52,37.52 21.34,37.52 21.34,10.85 9.52,10.85
VS2 on Bottom Layer: 9.52,37.52 21.34,37.52 21.34,10.85 9.52,10.85
$1N1166 on Top Layer: 17.04,45.9 72.14,45.9 72.14,26.72 17.04,26.72
$1N1166 on Bottom Layer: 17.04,45.9 72.14,45.9 72.14,26.72 17.04,26.72

## Text on the board
Top Silkscreen Layer: VGrid- | VGrid+ | VOUT- | VOUT+ | VS1 | VS2 | + | - | 电网电压检测 | 继电器 | 变换器电压检测 | 网侧电流检测 | 变换器侧电流检测 | 电容电流检测

# Board PCB1
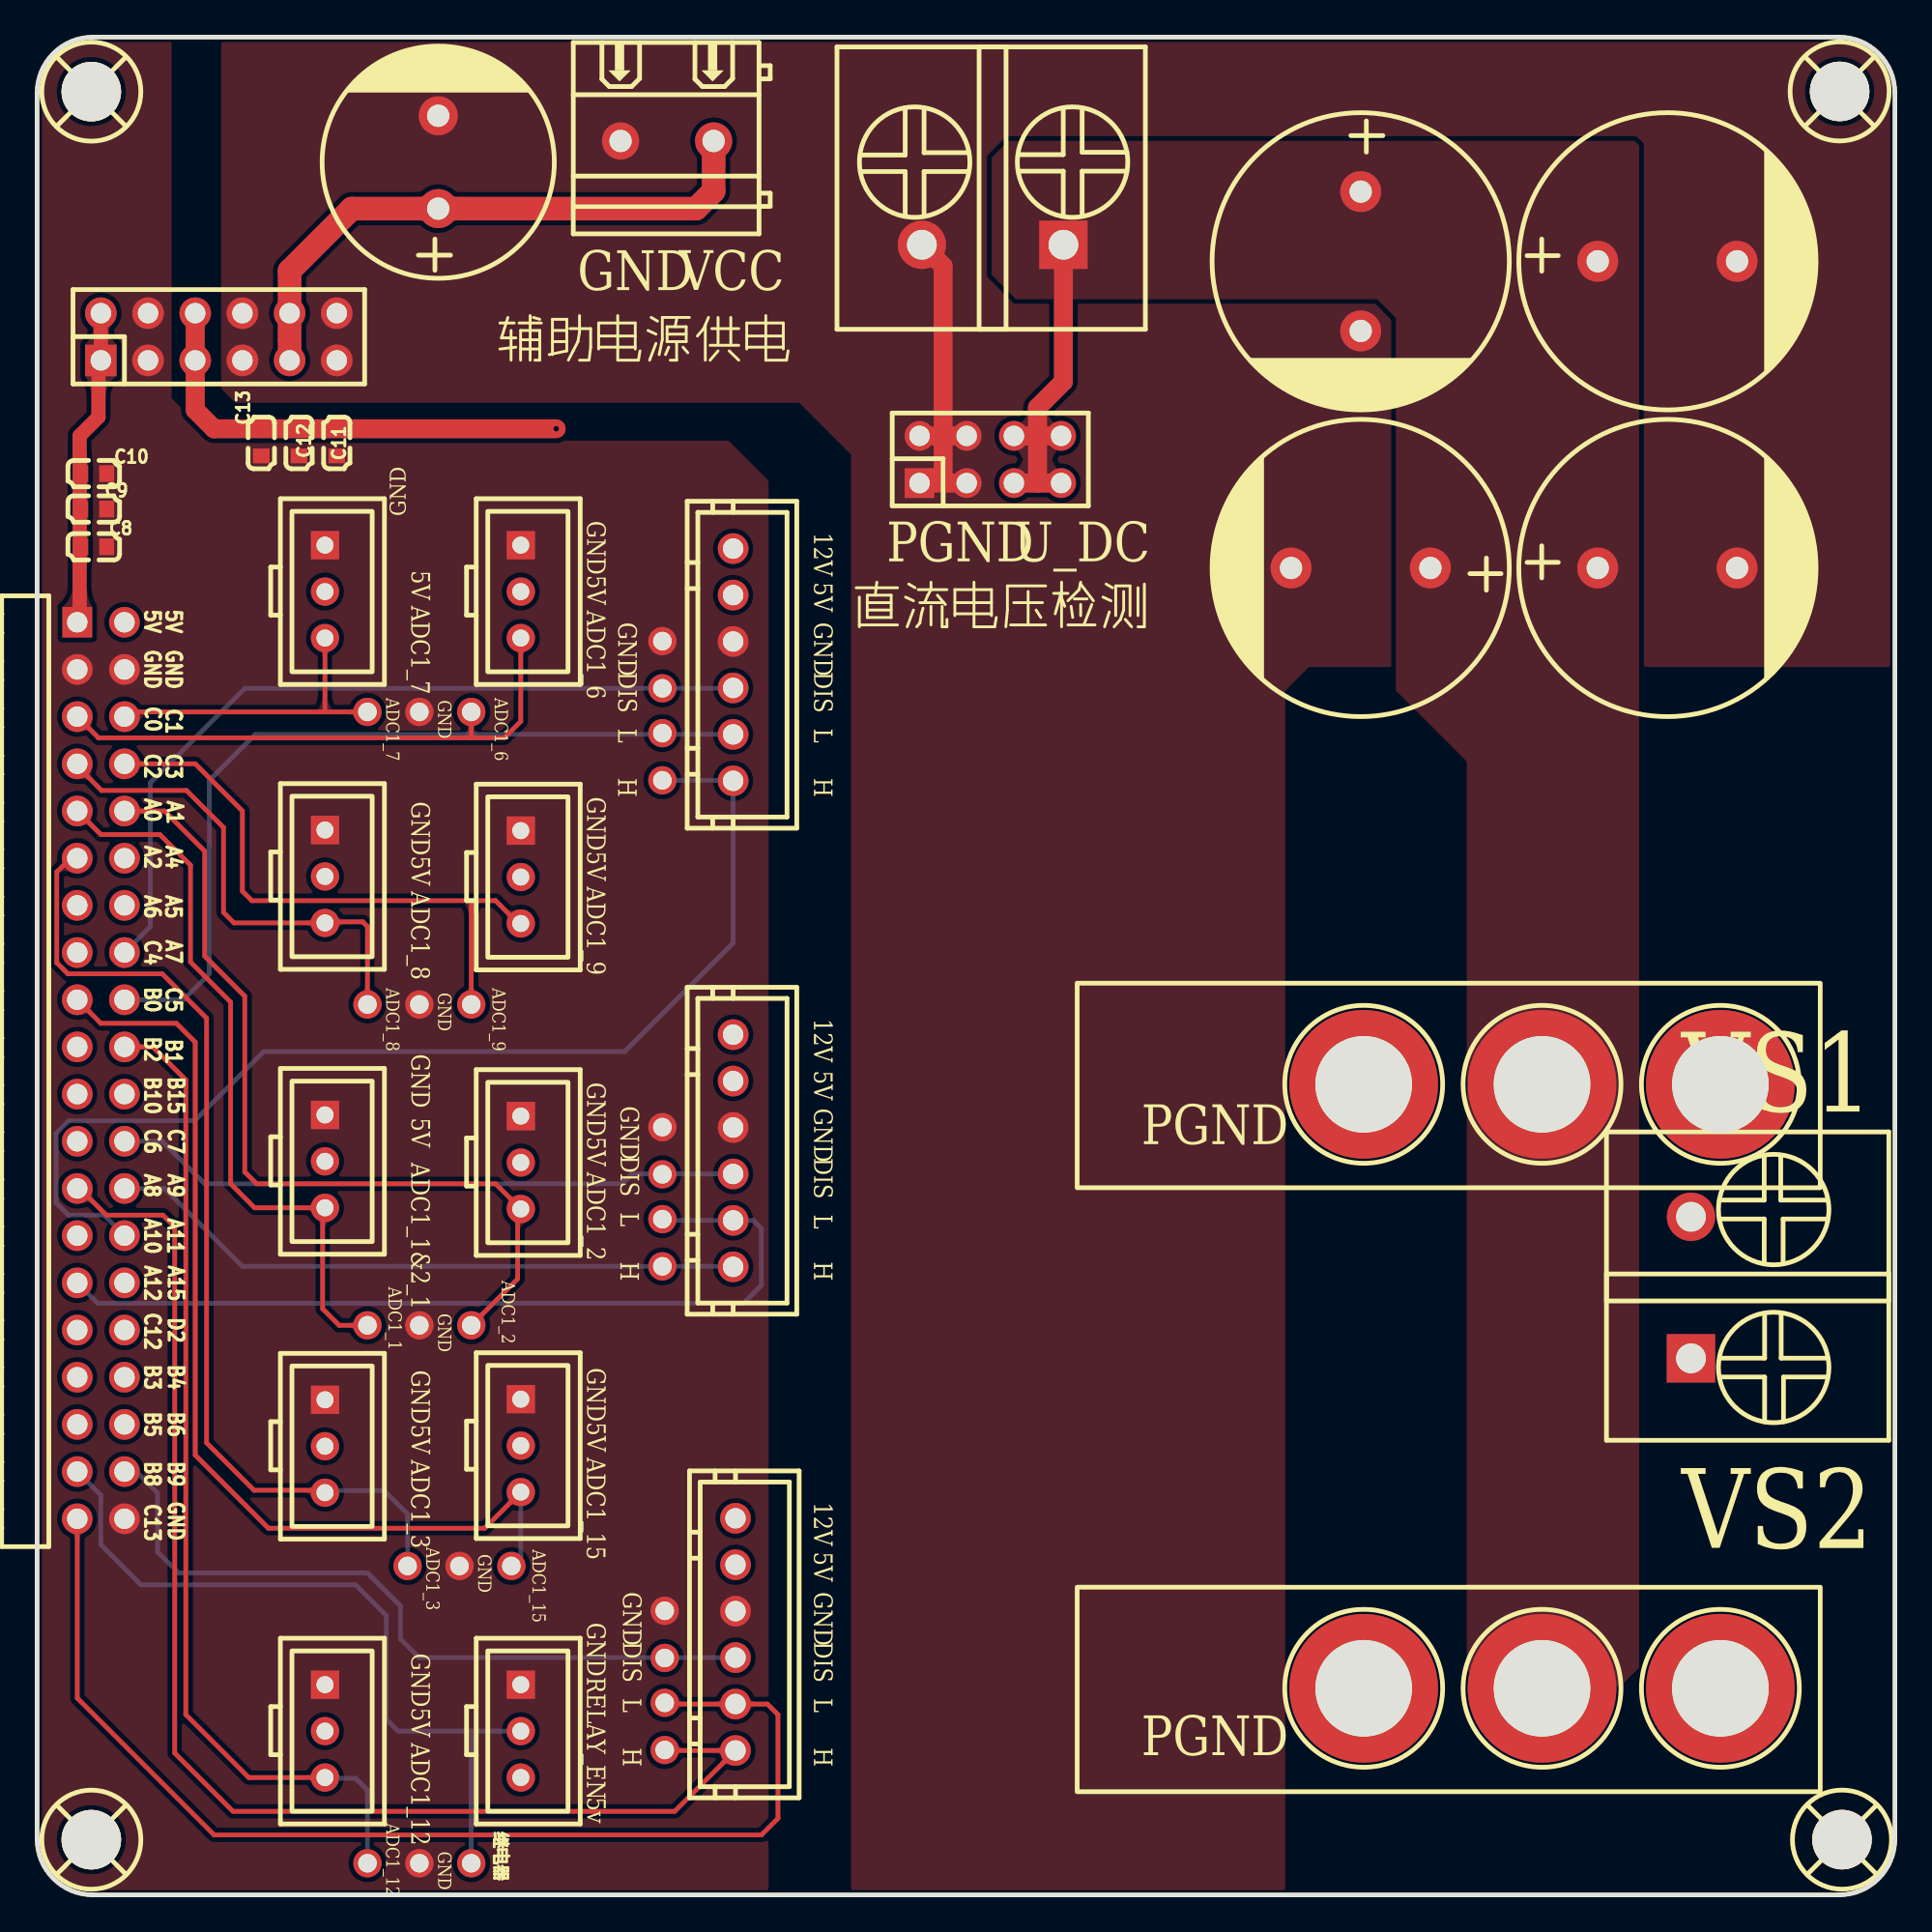
[diagram p5: board, top side]
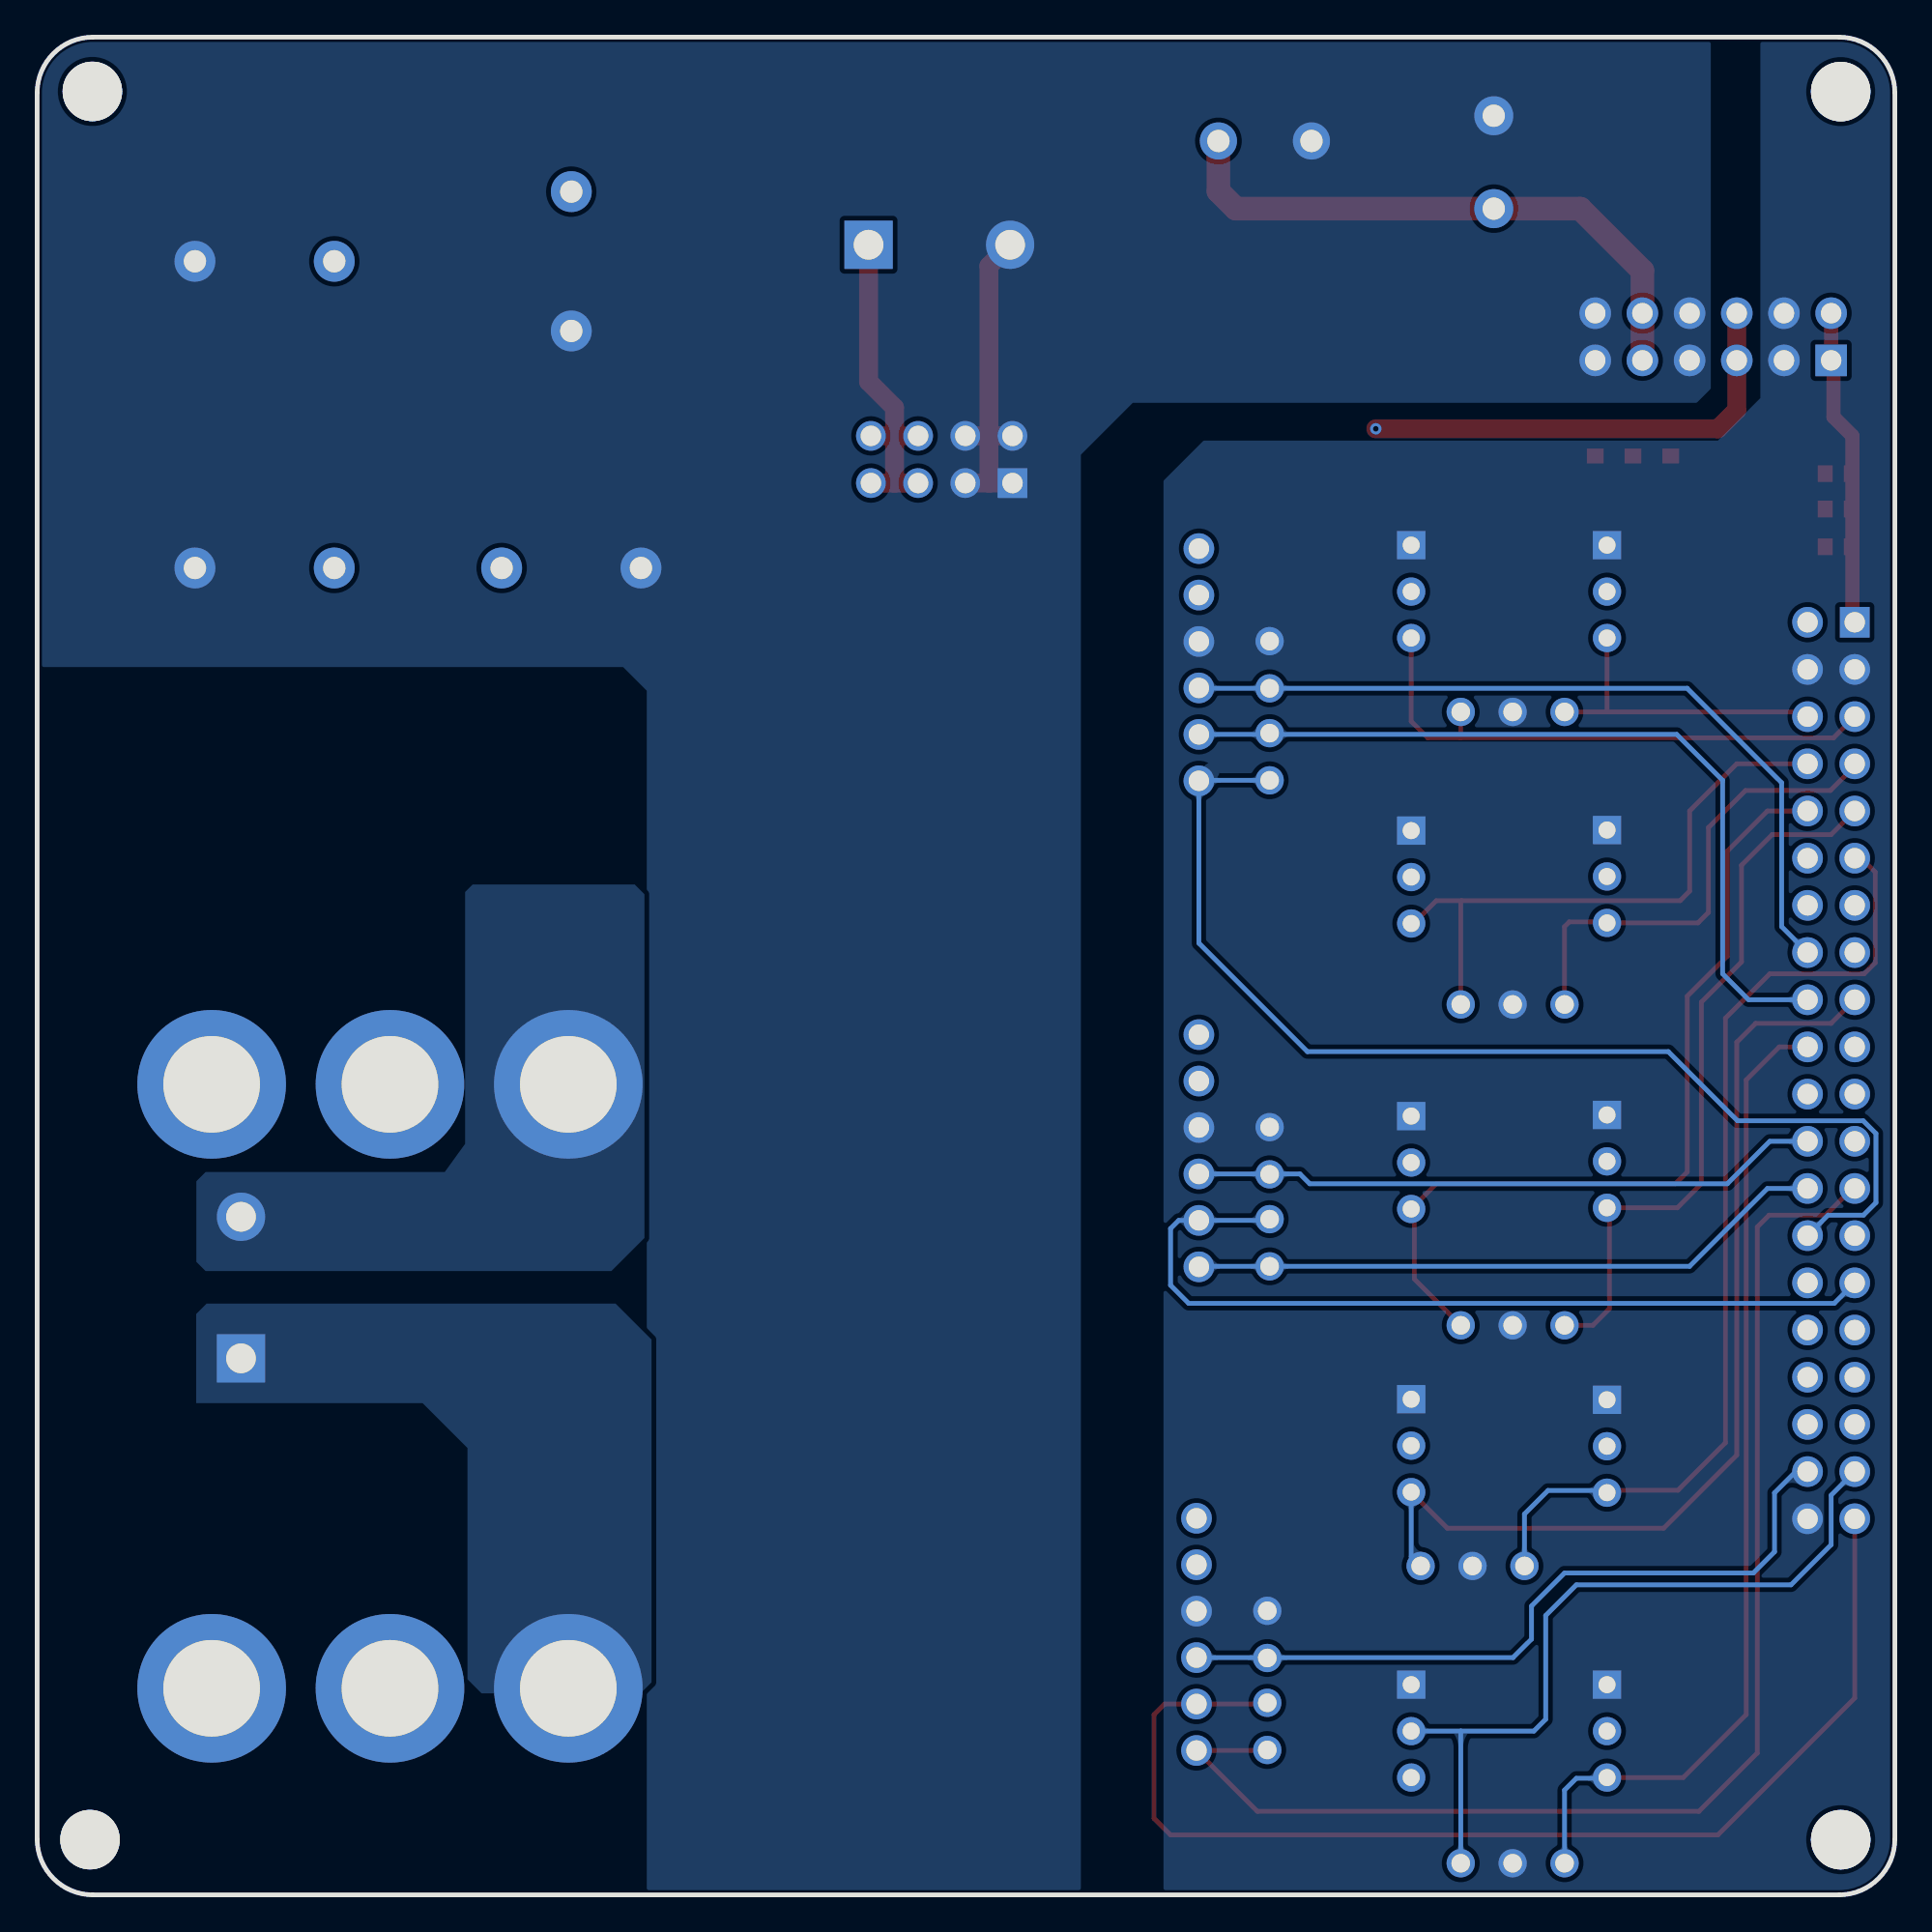
[diagram p6: board, bottom side, seen from below]

Outline 100 x 100 mm; copper layers: Top Layer, Inner1, Inner2, Bottom Layer. Coordinates in mm from the lower left corner of the outline.
Outline path: 0,97 0,3 arc(0.88,0.88) 3,0 97,0 arc(99.12,0.88) 100,3 100,97 arc(99.12,99.12) 97,100 3,100 arc(0.88,99.12) 0,97
Stack: Top Layer 0.035mm 外层铜厚1oz / Dielectric1 0.2104mm 7628 RC49% 8.6mil / Inner1 0.0152mm 内层铜厚 / Dielectric2 1.065mm 1.1mm H/HOZ Copper / Inner2 0.0152mm 内层铜厚 / Dielectric3 0.2104mm 7628 RC49% 8.6mil / Bottom Layer 0.035mm 外层铜厚1oz

## Design rules (mm)
template: 自定义配置
spacing copperThickness1oz (default): track to track 0.102, other pairs 0.152 to 0.3
spacing copperThickness2oz: track to track 0.203, other pairs 0.152 to 0.3
track width copperThickness1oz (default): min 0.127, default 0.254, max 2.54
track width copperThickness2oz: min 0.203, default 0.254, max 2.54
differential pair differentialPair (default): width min 0.127, default 0.254, max 2.54; gap min 0.152, default 0.152
via viaSize (default): diameter min 0.5, default 0.61, max 10; hole min 0.3, default 0.305, max 6.3

## Placement (name value [footprint] x y rotation side)
5VADC3GND3  WAFER-XH2.54-3PZZ  [CONN-TH_3P-P2.50_WAFER-XH2.54-3PZZ]  15.49 54.82 270 top
5VADC3GND4  WAFER-XH2.54-3PZZ  [CONN-TH_3P-P2.50_WAFER-XH2.54-3PZZ]  15.49 39.48 270 top
5VADC3GND5  WAFER-XH2.54-3PZZ  [CONN-TH_3P-P2.50_WAFER-XH2.54-3PZZ]  26.04 24.18 270 top
5VADC3GND6  WAFER-XH2.54-3PZZ  [CONN-TH_3P-P2.50_WAFER-XH2.54-3PZZ]  15.49 8.81 270 top
5VADC3GND7  WAFER-XH2.54-3PZZ  [CONN-TH_3P-P2.50_WAFER-XH2.54-3PZZ]  26.04 39.42 270 top
5VADC3GND8  WAFER-XH2.54-3PZZ  [CONN-TH_3P-P2.50_WAFER-XH2.54-3PZZ]  26.04 54.79 270 top
5VADC3GND9  WAFER-XH2.54-3PZZ  [CONN-TH_3P-P2.50_WAFER-XH2.54-3PZZ]  26.04 70.16 270 top
5VADC3GND10  WAFER-XH2.54-3PZZ  [CONN-TH_3P-P2.50_WAFER-XH2.54-3PZZ]  26.04 8.81 270 top
5VADC3GND11  WAFER-XH2.54-3PZZ  [CONN-TH_3P-P2.50_WAFER-XH2.54-3PZZ]  15.49 24.15 270 top
C1  470uF  [CAP-TH_BD16.0-P7.50-D0.8-FD]  87.76 71.43 0 top
C2  470uF  [CAP-TH_BD16.0-P7.50-D0.8-FD]  71.25 71.43 180 top
C3  470uF  [CAP-TH_BD16.0-P7.50-D0.8-FD]  71.25 87.94 270 top
C4  470uF  [CAP-TH_BD16.0-P7.50-D0.8-FD]  87.76 87.94 0 top
C7  220uf  [CAP-TH_BD12.5-P5.00-D0.6-FD]  21.59 93.27 90 top
C8  100nF  [C0603]  3.05 72.57 180 top
C9  1uF  [C0603]  3.05 74.6 180 top
C10  10uF  [C0603]  3.05 76.51 180 top
C11  100nF  [C0603]  16.13 78.16 90 top
C12  1uF  [C0603]  14.1 78.16 90 top
C13  22uF  [C0603]  12.06 78.16 90 top
CN2  WAFER-XH2.54-6PZZ  [CONN-TH_XH2.54-6P]  37.59 14.02 90 top
CN3  WAFER-XH2.54-6PZZ  [CONN-TH_XH2.54-6P]  37.47 40.06 90 top
CN4  WAFER-XH2.54-6PZZ  [CONN-TH_XH2.54-6P]  37.47 66.22 90 top
GND  WAFER-XH2.54-3PZZ  [CONN-TH_3P-P2.50_WAFER-XH2.54-3PZZ]  15.49 70.16 270 top
H1  HX PM2.54-2x4P ZC  [HDR-TH_8P-P2.54-V-F-R2-C4-S2.54-1]  51.31 77.27 0 top
NOREF  -  [Pad_e1631]  17.78 47.93 0 top
NOREF#2  -  [Pad_e1722]  33.78 10.34 0 top
NOREF#3  -  [Pad_e1726]  33.78 15.29 0 top
NOREF#4  -  [Pad_e1628]  17.78 63.68 0 top
NOREF#5  -  [Pad_e1737]  33.66 67.49 0 top
NOREF#6  -  [Pad_e1738]  33.66 62.54 0 top
NOREF#7  -  [Pad_e1656]  23.37 30.66 0 top
NOREF#8  -  [Pad_e1654]  20.57 30.66 0 top
NOREF#9  -  [Pad_e1629]  23.37 63.68 0 top
NOREF#10  -  [Pad_e1729]  33.66 36.37 0 top
NOREF#11  -  [Pad_e1739]  33.66 60 0 top
NOREF#12  -  [Pad_e1730]  33.66 33.83 0 top
NOREF#13  -  [Pad_e1728]  33.66 41.33 0 top
NOREF#14  -  [Pad_e1626]  20.57 63.68 0 top
NOREF#15  -  [Pad_e1727]  33.66 38.79 0 top
NOREF#16  -  [Pad_e1655]  17.78 30.66 0 top
NOREF#17  -  [Pad_e1668]  23.37 1.7 0 top
NOREF#18  -  [Pad_e1723]  33.78 12.75 0 top
NOREF#19  -  [Pad_e1667]  17.78 1.7 0 top
NOREF#20  -  [Pad_e1659]  25.53 17.7 0 top
NOREF#21  -  [Pad_e1666]  20.57 1.7 0 top
NOREF#22  -  [Pad_e1630]  20.57 47.93 0 top
NOREF#23  -  [Pad_e1632]  23.37 47.93 0 top
NOREF#24  -  [Pad_e1657]  22.73 17.7 0 top
NOREF#25  -  [Pad_e1721]  33.78 7.8 0 top
NOREF#26  -  [Pad_e1658]  19.94 17.7 0 top
NOREF#27  -  [Pad_e1736]  33.66 64.95 0 top
P3  WJ128V-5.0-2P  [CONN-TH_2P-P5.00_WJ128V-5.0-2P]  33.91 94.41 180 top
SCREW1  -  [M3螺丝]  2.92 97.07 0 top
SCREW2  -  [M3螺丝]  97.03 97.08 0 top
SCREW3  -  [M3螺丝]  97.16 2.97 0 top
SCREW4  -  [M3螺丝]  2.92 2.97 0 top
U1  -  [辅助电源板卡-60-12-5]  9.78 83.87 0 top
U5  直流侧  [CONN-TH_2P-P7.62_L15.2-W16.7-EX4.2]  51.44 88.82 180 top
U108  PZ254-2-20-W-8.5  [HDR-TH_40P-P2.54-H-M-R2-C20-S2.54-W12.9-N]  3.43 44.37 270 top
U109  桥臂输出  [CONN-TH_2P-P7.62_L15.2-W16.7-EX4.2]  89.03 32.69 90 top
U110  -  [ucc隔离半桥]  46.99 48.95 0 top
U111  -  [ucc隔离半桥]  46.99 16.43 0 top

## Footprints (pads in the part's own frame, mm; a bottom-side part is the same pattern mirrored in y, then rotated)
C0603
  rect 0.8x0.9 smd: 1(-0.7,0) 2(0.7,0)
CAP-TH_BD12.5-P5.00-D0.6-FD
  round 2.1 hole 1.2: 1(-2.5,0) 2(2.5,0)
CAP-TH_BD16.0-P7.50-D0.8-FD
  round 2.2 hole 1.2: 1(-3.75,0) 2(3.75,0)
CONN-TH_2P-P5.00_WJ128V-5.0-2P
  round 2 hole 1.2: 1(-2.505,0) 2(2.505,0)
CONN-TH_2P-P7.62_L15.2-W16.7-EX4.2
  rect 2.6x2.6 hole 1.6: 1(-3.81,0)
  round 2.6 hole 1.6: 2(3.81,0)
CONN-TH_3P-P2.50_WAFER-XH2.54-3PZZ
  rect 1.524x1.524 hole 0.914: 1(-2.5,0)
  round 1.524 hole 0.914: 2(0,0) 3(2.5,0)
CONN-TH_XH2.54-6P
  round 1.65 hole 1.1: 1(-6.25,0) 2(-3.75,0) 3(-1.25,0) 4(1.25,0) 5(3.75,0) 6(6.25,0)
HDR-TH_8P-P2.54-V-F-R2-C4-S2.54-1
  rect 1.6x1.6 hole 1.1: 1(-3.81,-1.27)
  round 1.6 hole 1.1: 2(-3.81,1.27) 3(-1.27,-1.27) 4(-1.27,1.27) 5(1.27,-1.27) 6(1.27,1.27) 7(3.81,-1.27) 8(3.81,1.27)
HDR-TH_40P-P2.54-H-M-R2-C20-S2.54-W12.9-N
  rect 1.65x1.6 hole 1.1: 1(-24.13,-1.27)
  round 1.65 hole 1.1: 2(-24.13,1.27) 3(-21.59,-1.27) 4(-21.59,1.27) 5(-19.05,-1.27) 6(-19.05,1.27) 7(-16.51,-1.27) 8(-16.51,1.27) 9(-13.97,-1.27) 10(-13.97,1.27) 11(-11.43,-1.27) 12(-11.43,1.27) 13(-8.89,-1.27) 14(-8.89,1.27) 15(-6.35,-1.27) 16(-6.35,1.27) 17(-3.81,-1.27) 18(-3.81,1.27) 19(-1.27,-1.27) 20(-1.27,1.27) 21(1.27,-1.27) 22(1.27,1.27) 23(3.81,-1.27) 24(3.81,1.27) 25(6.35,-1.27) 26(6.35,1.27) 27(8.89,-1.27) 28(8.89,1.27) 29(11.43,-1.27) 30(11.43,1.27) 31(13.97,-1.27) 32(13.97,1.27) 33(16.51,-1.27) 34(16.51,1.27) 35(19.05,-1.27) 36(19.05,1.27) 37(21.59,-1.27) 38(21.59,1.27) 39(24.13,-1.27) 40(24.13,1.27)
M3螺丝
  round 3.2 hole 3.2: 1(0,0)
Pad_e1626
  round 1.524 hole 1: 1(0,0)
Pad_e1628
  round 1.524 hole 1: 1(0,0)
Pad_e1629
  round 1.524 hole 1: 1(0,0)
Pad_e1630
  round 1.524 hole 1: 1(0,0)
Pad_e1631
  round 1.524 hole 1: 1(0,0)
Pad_e1632
  round 1.524 hole 1: 1(0,0)
Pad_e1654
  round 1.524 hole 1: 1(0,0)
Pad_e1655
  round 1.524 hole 1: 1(0,0)
Pad_e1656
  round 1.524 hole 1: 1(0,0)
Pad_e1657
  round 1.524 hole 1: 1(0,0)
Pad_e1658
  round 1.524 hole 1: 1(0,0)
Pad_e1659
  round 1.524 hole 1: 1(0,0)
Pad_e1666
  round 1.524 hole 1: 1(0,0)
Pad_e1667
  round 1.524 hole 1: 1(0,0)
Pad_e1668
  round 1.524 hole 1: 1(0,0)
Pad_e1721
  round 1.524 hole 1: 1(0,0)
Pad_e1722
  round 1.524 hole 1: 1(0,0)
Pad_e1723
  round 1.524 hole 1: 1(0,0)
Pad_e1726
  round 1.524 hole 1: 1(0,0)
Pad_e1727
  round 1.524 hole 1: 1(0,0)
Pad_e1728
  round 1.524 hole 1: 1(0,0)
Pad_e1729
  round 1.524 hole 1: 1(0,0)
Pad_e1730
  round 1.524 hole 1: 1(0,0)
Pad_e1736
  round 1.524 hole 1: 1(0,0)
Pad_e1737
  round 1.524 hole 1: 1(0,0)
Pad_e1738
  round 1.524 hole 1: 1(0,0)
Pad_e1739
  round 1.524 hole 1: 1(0,0)
ucc隔离半桥
  round 8 hole 5.2: 1(24.418,-5.316) 2(34.018,-5.316) 3(43.618,-5.316)
辅助电源板卡-60-12-5
  rect 1.7x1.7 hole 1.1: 1(-6.35,-1.27)
  round 1.7 hole 1.1: 2(-6.35,1.27) 3(-3.81,-1.27) 4(-3.81,1.27) 5(-1.27,-1.27) 6(-1.27,1.27) 7(1.27,-1.27) 8(1.27,1.27) 9(3.81,-1.27) 10(3.81,1.27) 11(6.35,-1.27) 12(6.35,1.27)

## Nets
5V: 5VADC3GND3.2 5VADC3GND4.2 5VADC3GND5.2 5VADC3GND6.2 5VADC3GND7.2 5VADC3GND8.2 5VADC3GND9.2 5VADC3GND10.3 5VADC3GND11.2 C8.2 C9.2 C10.2 CN2.5 CN3.5 CN4.5 GND.2 U1.1 U1.2 U108.1 U108.2
12V: C11.2 C12.2 C13.2 CN2.6 CN3.6 CN4.6 U1.5 U1.6
AGND: 5VADC3GND3.1 5VADC3GND4.1 5VADC3GND5.1 5VADC3GND6.1 5VADC3GND7.1 5VADC3GND8.1 5VADC3GND9.1 5VADC3GND10.1 5VADC3GND11.1 C8.1 C9.1 C10.1 C11.1 C12.1 C13.1 CN2.4 CN3.4 CN4.4 GND.1 NOREF#3.1 NOREF#5.1 NOREF#8.1 NOREF#13.1 NOREF#14.1 NOREF#21.1 NOREF#22.1 NOREF#24.1 U1.3 U1.4 U108.3 U108.4 U108.40
PGND: C1.2 C2.2 C3.2 C4.2 C7.2 H1.1 H1.2 H1.3 H1.4 P3.2 U1.7 U1.8 U1.11 U1.12 U5.2 U110.1 U111.1
VCC: C7.1 P3.1 U1.9 U1.10
ADC1_1&2_1: 5VADC3GND4.3 NOREF#16.1 U108.9
ADC1_2: 5VADC3GND7.3 NOREF#7.1 U108.10
ADC1_3: 5VADC3GND11.3 NOREF#26.1 U108.11
ADC1_6: 5VADC3GND9.3 NOREF#9.1 U108.5
ADC1_7: GND.3 NOREF#4.1 U108.6
ADC1_8: 5VADC3GND3.3 NOREF.1 U108.7
ADC1_9: 5VADC3GND8.3 NOREF#23.1 U108.8
ADC1_12: 5VADC3GND6.3 NOREF#19.1 U108.20
ADC1_15: 5VADC3GND5.3 NOREF#20.1 U108.17
DIS1: CN2.3 NOREF#18.1 U108.38
DIS2: CN3.3 NOREF#15.1 U108.24
DIS3: CN4.3 NOREF#27.1 U108.16
I_DC+: C1.1 C2.1 C3.1 C4.1 H1.5 H1.6 H1.7 H1.8 U5.1 U110.3 U111.3
PA4: U108.12
PA5: U108.14
PA6: U108.13
PA8: CN2.1 NOREF#25.1 U108.25
PA9: CN3.1 NOREF#12.1 U108.26
PA10: U108.27
PA11: CN4.1 NOREF#11.1 U108.28
PA12: CN3.2 NOREF#10.1 U108.29
PA15: U108.30
PB2: U108.19
PB3: U108.33
PB4: U108.34
PB5: U108.35
PB6: U108.36
PB7: 5VADC3GND10.2 NOREF#17.1 U108.37
PB10: U108.21
PB15: U108.22
PC4: U108.15
PC5: CN4.2 NOREF#6.1 U108.18
PC6: U108.23
PC12: U108.31
PC13: CN2.2 NOREF#2.1 U108.39
PD2: U108.32
VS1: U109.2 U110.2
VS2: U109.1 U111.2

Pads without a net: SCREW1 1; SCREW2 1; SCREW3 1; SCREW4 1

## Via types
v1: diameter 0.61, hole 0.305, Top Layer to Bottom Layer, 1 via

## Routing (per net, layer and track width the routed paths; a pad name or vN(x,y) marks a point on that pad's centre or on a via; arc(x,y) is an arc through that point)
5V: length 214.7
  Top Layer w0.762: 2.54,68.5 2.48,68.5 2.29,68.69 2.29,78.54 3.3,79.55 3.3,82.47 U1.1 U1.2
  Inner2 w0.762: 10.41,24.22 10.41,8.81 ; 10.41,24.22 15.43,24.22 ; 10.41,24.22 10.41,39.42 ; 10.41,8.81 10.41,5.64 12.06,3.99 23.71,3.99 5VADC3GND10.3 ; 10.41,8.81 5VADC3GND6.2 ; 10.5,70.16 7.87,70.16 6.22,68.5 U108.2 U108.1 ; 10.5,70.16 10.41,70.07 10.41,54.85 ; 10.5,70.16 GND.2 5VADC3GND9.2 37.15,70.16 37.47,69.84 ; CN3.5 34.1,43.81 29.72,39.42 5VADC3GND7.2 10.41,39.42 ; 10.41,39.42 10.41,54.85 ; 10.41,54.85 25.98,54.85 5VADC3GND8.2 ; 15.43,24.22 25.78,24.22 25.82,24.18 5VADC3GND5.2 31.18,24.18 CN2.5 ; 15.43,24.22 5VADC3GND11.2
12V: length 106
  Top Layer w1.016: U1.6 U1.5 8.51,79.93 9.53,78.92 v1(27.94,78.92)
  Inner1 w1.016: CN3.6 37.49,46.28 41.91,46.28 ; 41.91,46.28 41.91,24.59 CN2.6 ; 41.91,46.28 41.91,72.37 ; 41.91,72.37 41.91,74.85 37.85,78.92 v1(27.94,78.92) ; 41.91,72.37 37.57,72.37 CN4.6
PGND: length 18.4
  Top Layer w1.016: 48.77,76 H1.3 ; 48.77,76 H1.1 ; 48.77,76 48.77,78.54 ; 48.77,78.54 H1.2 ; 48.77,78.54 48.77,87.68 U5.2 ; 48.77,78.54 H1.4
VCC: length 32.1
  Top Layer w1.27: P3.1 36.41,91.71 35.47,90.77 C7.1 16.93,90.77 13.59,87.43 U1.10 U1.9
ADC1_1&2_1: length 39.2
  Top Layer w0.254: NOREF#16.1 16.26,30.66 15.37,31.55 15.37,36.86 5VADC3GND4.3 11.71,36.98 10.41,38.28 10.41,48.06 8.26,50.22 8.26,55.42 6.6,57.07 3.43,57.07 U108.9
ADC1_2: length 46.5
  Top Layer w0.254: 25.86,37.09 5VADC3GND7.3 ; 25.86,37.09 24.68,38.28 11.81,38.28 11.18,38.91 11.18,48.37 9.02,50.53 9.02,56.19 6.86,58.34 U108.10 ; 25.86,37.09 25.86,33.15 NOREF#7.1
ADC1_3: length 53.8
  Top Layer w0.254: 5VADC3GND11.3 15.37,21.78 11.68,21.78 9.12,24.33 9.12,47.19 6.73,49.58 1.65,49.58 1.06,50.18 1.06,55.06 1.8,55.8 U108.11
  Bottom Layer w0.254: NOREF#26.1 19.94,20.5 18.67,21.77 15.61,21.77 5VADC3GND11.3
ADC1_6: length 30.6
  Top Layer w0.254: 23.39,62.28 3.3,62.28 U108.5 ; 23.39,62.28 25.15,62.28 26.04,63.17 5VADC3GND9.3 ; 23.39,62.28 23.37,62.3 NOREF#9.1
ADC1_7: length 17.2
  Top Layer w0.254: NOREF#4.1 15.49,63.68 ; 15.49,63.68 15.49,63.68 GND.3 ; 15.49,63.68 4.95,63.68 U108.6
ADC1_8: length 26.3
  Top Layer w0.254: NOREF.1 17.78,52.12 17.53,52.38 15.55,52.38 5VADC3GND3.3 10.6,52.32 10.03,52.88 10.03,57.46 8.04,59.45 3.47,59.45 2.03,60.88
ADC1_9: length 33
  Top Layer w0.254: NOREF#23.1 23.37,53.48 23.33,53.52 ; 23.33,53.52 11.56,53.52 11.05,54.03 11.05,58.34 8.51,60.88 U108.8 ; 23.33,53.52 24.68,53.52 25.91,52.29 5VADC3GND8.3
ADC1_12: length 53.6
  Top Layer w0.254: U108.20 6.22,45.64 8,43.87 8,9.7 11.39,6.31 5VADC3GND6.3
  Bottom Layer w0.254: NOREF#19.1 17.78,5.64 17.15,6.27 15.53,6.27 5VADC3GND6.3
ADC1_15: length 53.7
  Top Layer w0.254: 5VADC3GND5.3 24.09,19.74 12.45,19.74 8.51,23.67 8.51,45.9 7.49,46.91 3.43,46.91 U108.17
  Bottom Layer w0.254: 5VADC3GND5.3 26.04,18.21 NOREF#20.1
DIS1: length 39.9
  Bottom Layer w0.254: U108.38 5.33,22.78 6.48,21.64 6.48,18.47 7.62,17.32 17.78,17.32 19.56,15.55 19.56,13.77 20.55,12.77 CN2.3
DIS2: length 33.9
  Bottom Layer w0.254: U108.24 6.73,40.56 9.02,38.28 31.5,38.28 32.02,38.81 CN3.3
DIS3: length 43.2
  Bottom Layer w0.254: CN4.3 37.45,64.95 NOREF#27.1 11.18,64.95 6.1,59.87 6.1,52.12 U108.16
I_DC+: length 18.5
  Top Layer w1.016: H1.6 53.85,78.54 ; 53.85,78.54 H1.8 ; 53.85,78.54 53.85,80.06 55.25,81.46 U5.1 ; 53.85,78.54 53.85,76 ; 53.85,76 H1.7 ; 53.85,76 H1.5
PA8: length 71
  Top Layer w0.254: 2.29,38.02 3.72,36.59 6.77,36.59 7.41,35.95 7.41,7.63 10.54,4.5 34.32,4.5 CN2.1 33.81,7.77 NOREF#25.1
PA9: length 34.5
  Bottom Layer w0.254: CN3.1 37.44,33.83 NOREF#12.1 11.05,33.83 6.86,38.02 U108.26
PA11: length 61.4
  Bottom Layer w0.254: U108.28 3.59,36.59 1.69,36.59 1.02,37.26 1.02,40.98 1.7,41.67 8.47,41.67 12.19,45.39 31.62,45.39 37.47,51.23 CN4.1 37.44,60 NOREF#11.1
PA12: length 46.3
  Bottom Layer w0.254: NOREF#10.1 33.72,36.31 CN3.2 38.55,36.31 38.99,35.87 38.99,32.82 38.01,31.84 3.26,31.84 U108.29
PB7: length 41.6
  Bottom Layer w0.254: U108.37 3.43,21.51 3.43,18.85 5.59,16.69 17.15,16.69 18.8,15.04 18.8,9.45 19.43,8.81 23.37,8.81 ; 5VADC3GND10.2 23.37,8.81 ; 23.37,8.81 23.37,8.81 NOREF#17.1
PC5: length 44.8
  Bottom Layer w0.254: CN4.2 11.74,62.47 9.27,60 9.27,49.58 7.87,48.18 U108.18
PC13: length 62.7
  Top Layer w0.254: U108.39 2.16,10.59 9.53,3.23 38.99,3.23 39.88,4.12 39.88,9.7 39.31,10.27 CN2.2 33.85,10.27 NOREF#2.1

## Copper pours and planes (outline as drawn; the poured copper is in the pictures)
AGND on Top Layer: 7.24,107.37 7.24,80.57 9.53,78.28 37.21,78.28 39.37,76.12 39.37,-3.89 37.72,-5.54 -3.17,-5.54 -9.4,0.69 -9.4,106.6 -8.38,107.62 6.98,107.62
AGND on Bottom Layer: 7.24,107.37 7.24,80.57 9.53,78.28 37.21,78.28 39.37,76.12 39.37,-3.89 37.72,-5.54 -3.17,-5.54 -9.4,0.69 -9.4,106.6 -8.38,107.62 6.98,107.62
PGND on Top Layer: 9.91,81.08 10.67,80.32 41.02,80.32 43.82,77.52 43.82,-4.52 46.61,-7.31 64.52,-7.31 67.18,-4.65 67.18,64.82 68.45,66.09 102.49,66.09 104.77,68.38 104.77,103.56 99.95,108.38 10.92,108.38 9.91,107.37
PGND on Bottom Layer: 9.91,81.08 10.67,80.32 41.02,80.32 43.82,77.52 43.82,-4.52 46.61,-7.31 64.52,-7.31 67.18,-4.65 67.18,64.82 68.45,66.09 102.49,66.09 104.77,68.38 104.77,103.56 99.95,108.38 10.92,108.38 9.91,107.37
I_DC+ on Top Layer: 51.39,94.41 86.23,94.41 86.23,11.23 51.39,11.23
I_DC+ on Top Layer: 51.39,94.41 86.23,94.41 86.23,11.23 51.39,11.23
VS1 on Bottom Layer: 67.31,54.39 91.43,54.39 91.43,33.58 67.31,33.58
VS2 on Bottom Layer: 66.93,31.83 91.44,31.83 91.44,10.85 66.93,10.85

Small or netless copper shapes (teardrops, artwork), in the pictures only: 71 on Top Layer, 38 on Bottom Layer, 5 on Inner1, 28 on Inner2

## Text on the board
Top Silkscreen Layer: A8 | 5V | GND | C2 | A0 | A2 | A6 | C4 | B0 | B2 | B10 | C6 | A10 | A12 | C12 | B3 | B5 | B8 | C13 | C0 | A5 | C1 | C3 | A4 | A7 | C5 | B1 | A1 | A11 | A9 | B15 | C7 | A15 | D2 | B4 | B6 | B9 | ADC1_7 | ADC1_8 | ADC1_12 | ADC1_1 | ADC1_3 | ADC1_9 | ADC1_6 | 继电器 | ADC1_2 | ADC1_15 | ADC1_1&2_1 | RELAY_EN | 5v | L | H | DIS | 12V | 辅助电源供电 | VCC | 直流电压检测 | PGND | U_DC | VS1 | VS2

# Board PCB3
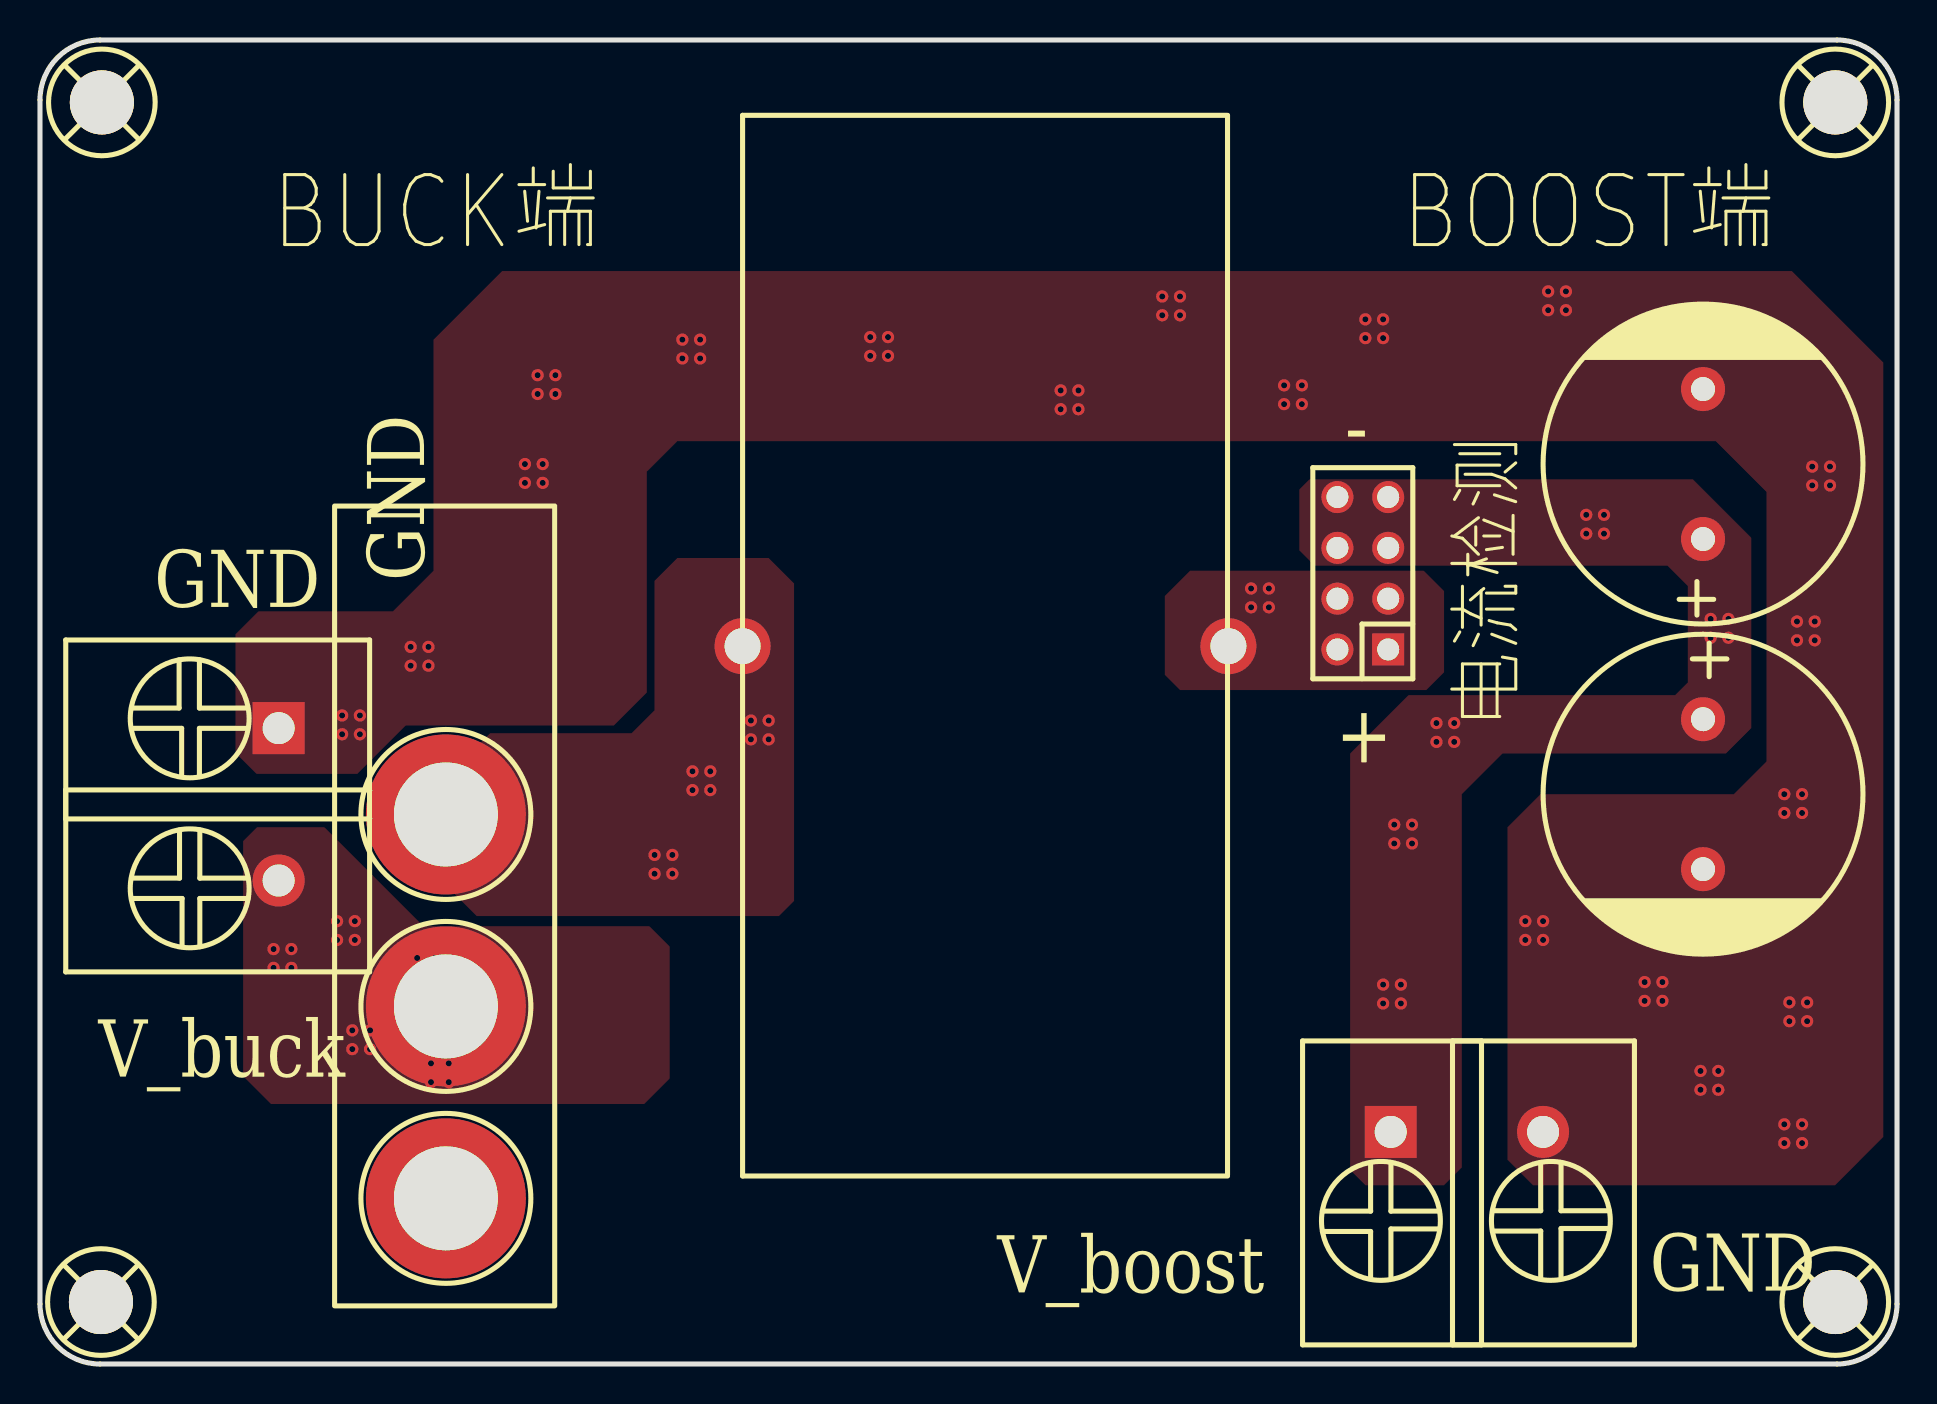
[diagram p7: board, top side]
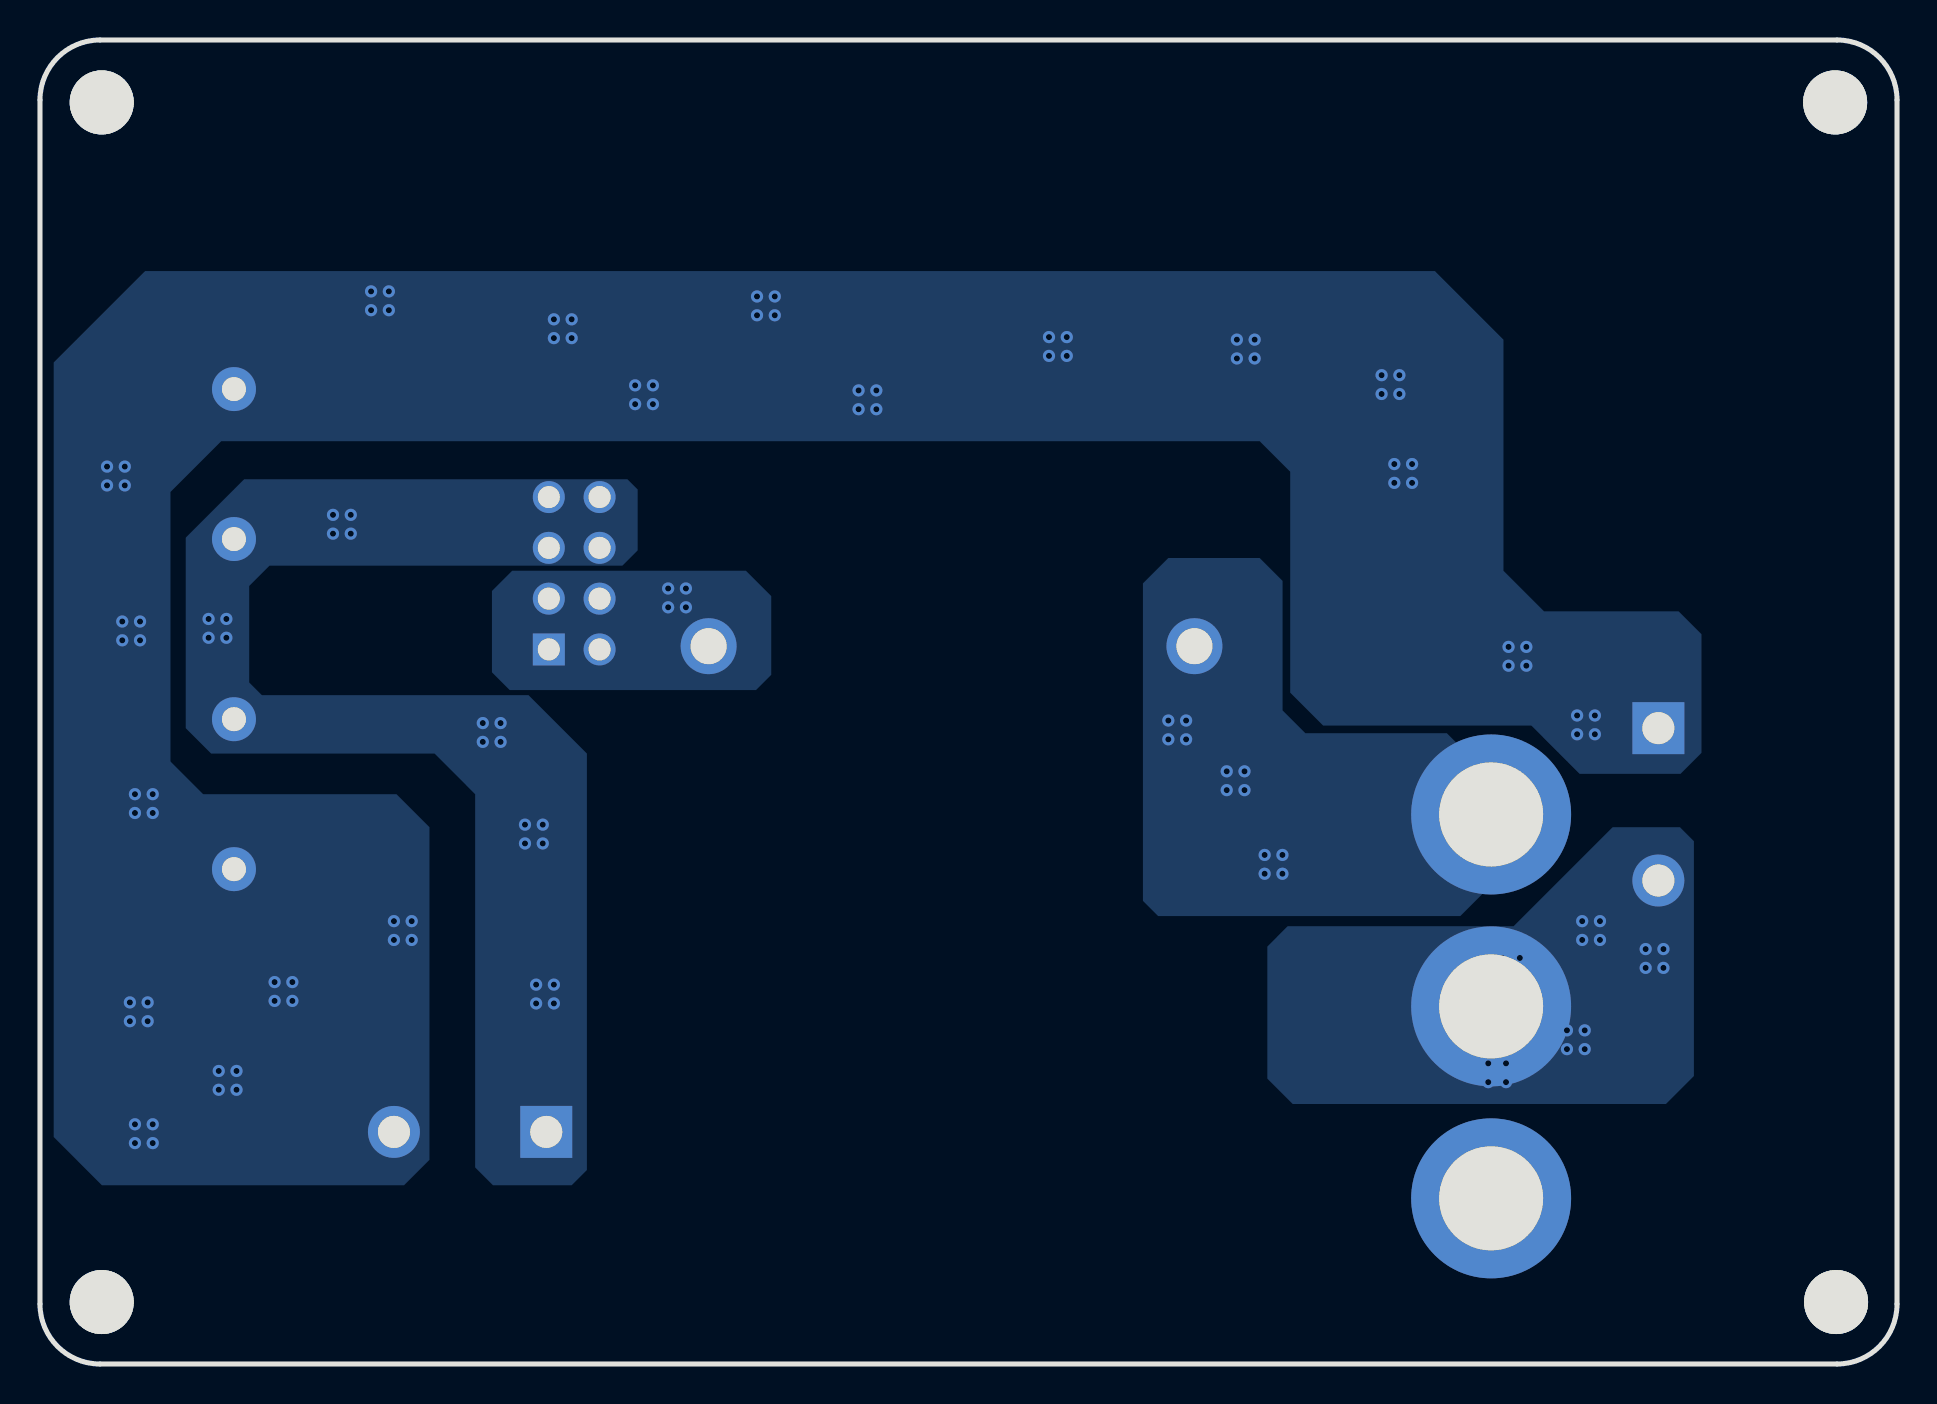
[diagram p8: board, bottom side, seen from below]

Outline 92.89 x 66.22 mm; copper layers: Top Layer, Bottom Layer. Coordinates in mm from the lower left corner of the outline.
Outline path: 0,63.22 0,3 arc(0.88,0.88) 3,0 89.89,0 arc(92.01,0.88) 92.89,3 92.89,63.22 arc(92.01,65.34) 89.89,66.22 3,66.22 arc(0.88,65.34) 0,63.22
Stack: Top Layer 0.035mm / Dielectric1 1.51mm FR4 er 4.5 / Bottom Layer 0.035mm

## Design rules (mm)
template: JLCPCB Capability(Two Layers Board)
spacing copperThickness1oz (default): track to track 0.102, other pairs 0.152 to 0.3
spacing copperThickness2oz: track to track 0.203, other pairs 0.152 to 0.3
track width copperThickness1oz (default): min 0.127, default 0.254, max 2.54
track width copperThickness2oz: min 0.203, default 0.254, max 2.54
differential pair differentialPair (default): width min 0.127, default 0.254, max 2.54; gap min 0.152, default 0.152
via viaSize (default): diameter min 0.5, default 0.61, max 10; hole min 0.3, default 0.305, max 6.3

## Placement (name value [footprint] x y rotation side)
C3  470uF  [CAP-TH_BD16.0-P7.50-D0.8-FD]  83.19 28.5 270 top
C4  470uF  [CAP-TH_BD16.0-P7.50-D0.8-FD]  83.19 45.01 90 top
H8  电感电流检测  [HDR-TH_8P-P2.54-V-F-R2-C4-S2.54-1]  66.17 39.55 90 top
L2  2.5mH  [直插环形电感]  35.14 35.9 0 top
SCREW1  -  [M3螺丝]  3.05 3.1 90 top
SCREW2  -  [M3螺丝]  89.8 63.1 90 top
SCREW3  -  [M3螺丝]  3.09 63.1 90 top
SCREW4  -  [M3螺丝]  89.8 3.1 90 top
U5  高压端  [CONN-TH_2P-P7.62_L15.2-W16.7-EX4.2]  11.94 27.99 270 top
U111  -  [ucc隔离半桥]  25.62 51.9 270 top
U112  低压端  [CONN-TH_2P-P7.62_L15.2-W16.7-EX4.2]  71.37 11.61 0 top

## Footprints (pads in the part's own frame, mm; a bottom-side part is the same pattern mirrored in y, then rotated)
CAP-TH_BD16.0-P7.50-D0.8-FD
  round 2.2 hole 1.2: 1(-3.75,0) 2(3.75,0)
CONN-TH_2P-P7.62_L15.2-W16.7-EX4.2
  rect 2.6x2.6 hole 1.6: 1(-3.81,0)
  round 2.6 hole 1.6: 2(3.81,0)
HDR-TH_8P-P2.54-V-F-R2-C4-S2.54-1
  rect 1.6x1.6 hole 1.1: 1(-3.81,-1.27)
  round 1.6 hole 1.1: 2(-3.81,1.27) 3(-1.27,-1.27) 4(-1.27,1.27) 5(1.27,-1.27) 6(1.27,1.27) 7(3.81,-1.27) 8(3.81,1.27)
M3螺丝
  round 3.2 hole 3.2: 1(0,0)
ucc隔离半桥
  round 8 hole 5.2: 1(24.418,-5.316) 2(34.018,-5.316) 3(43.618,-5.316)
直插环形电感
  round 2.8 hole 1.8: 1(0,0) 2(24.3,0)

## Nets
As in the schematic.

Pads without a net: SCREW1 1; SCREW2 1; SCREW3 1; SCREW4 1

## Via types
v1: diameter 0.61, hole 0.305, Top Layer to Bottom Layer, 132 vias

## Routing (per net, layer and track width the routed paths; a pad name or vN(x,y) marks a point on that pad's centre or on a via; arc(x,y) is an arc through that point)
PGND:
  vias: v1(15.11,32.44) v1(15.11,31.5) v1(16,32.44) v1(16,31.5) v1(18.54,35.86) v1(18.54,34.92) v1(19.43,35.86) v1(19.43,34.92) v1(24.26,45.01) v1(24.26,44.07) v1(24.89,49.45) v1(24.89,48.51) v1(25.15,45.01) v1(25.15,44.07) v1(25.78,49.45) v1(25.78,48.51) v1(32.13,51.23) v1(32.13,50.29) v1(33.02,51.23) v1(33.02,50.29) v1(41.53,51.36) v1(41.53,50.42) v1(42.42,51.36) v1(42.42,50.42) v1(51.05,48.69) v1(51.05,47.75) v1(51.94,48.69) v1(51.94,47.75) v1(56.13,53.39) v1(56.13,52.45) v1(57.02,53.39) v1(57.02,52.45) v1(62.23,48.95) v1(62.23,48.01) v1(63.12,48.95) v1(63.12,48.01) v1(66.29,52.25) v1(66.29,51.31) v1(67.18,52.25) v1(67.18,51.31) v1(74.29,22.15) v1(74.29,21.21) v1(75.18,22.15) v1(75.18,21.21) v1(75.44,53.64) v1(75.44,52.7) v1(76.33,53.64) v1(76.33,52.7) v1(80.26,19.1) v1(80.26,18.16) v1(81.15,19.1) v1(81.15,18.16) v1(83.06,14.66) v1(83.06,13.72) v1(83.95,14.66) v1(83.95,13.72) v1(87.25,28.5) v1(87.25,27.56) v1(87.25,11.99) v1(87.25,11.05) v1(87.5,18.08) v1(87.5,17.14) v1(87.88,37.14) v1(87.88,36.19) v1(88.14,28.5) v1(88.14,27.56) v1(88.14,11.99) v1(88.14,11.05) v1(88.39,18.08) v1(88.39,17.14) v1(88.65,44.88) v1(88.65,43.94) v1(88.77,37.14) v1(88.77,36.19) v1(89.53,44.88) v1(89.53,43.94)
IL+:
  vias: v1(60.58,38.79) v1(60.58,37.85) v1(61.47,38.79) v1(61.47,37.85)
IL-:
  vias: v1(67.18,18.97) v1(67.18,18.03) v1(67.74,26.97) v1(67.74,26.03) v1(68.07,18.97) v1(68.07,18.03) v1(68.63,26.97) v1(68.63,26.03) v1(69.85,32.06) v1(69.85,31.11) v1(70.74,32.06) v1(70.74,31.11) v1(77.34,42.47) v1(77.34,41.53) v1(78.23,42.47) v1(78.23,41.53) v1(83.57,37.26) v1(83.57,36.32) v1(84.46,37.26) v1(84.46,36.32)
V_BUCK:
  vias: v1(11.68,20.75) v1(11.68,19.81) v1(12.57,20.75) v1(12.57,19.81) v1(14.86,22.15) v1(14.86,21.21) v1(15.62,16.69) v1(15.62,15.75) v1(15.75,22.15) v1(15.75,21.21) v1(16.51,16.69) v1(16.51,15.75) v1(18.87,20.31) v1(18.87,19.37) v1(19.56,15.04) v1(19.56,14.1) v1(19.75,20.31) v1(19.75,19.37) v1(20.45,15.04) v1(20.45,14.1)
VS:
  vias: v1(30.74,25.46) v1(30.74,24.52) v1(31.63,25.46) v1(31.63,24.52) v1(32.64,29.64) v1(32.64,28.7) v1(33.53,29.64) v1(33.53,28.7) v1(35.56,32.18) v1(35.56,31.24) v1(36.45,32.18) v1(36.45,31.24)

## Copper pours and planes (outline as drawn; the poured copper is in the pictures)
PGND on Top Layer: 9.78,54.66 92.2,54.66 92.2,8.94 9.78,8.94
PGND on Bottom Layer: 9.78,54.66 92.2,54.66 92.2,8.94 9.78,8.94
IL+ on Top Layer: 56.26,39.67 70.23,39.67 70.23,33.71 56.26,33.71
IL+ on Bottom Layer: 56.31,39.67 70.28,39.67 70.28,33.71 56.31,33.71
IL- on Top Layer: 62.99,44.25 85.6,44.25 85.6,8.94 62.99,8.94
IL- on Bottom Layer: 62.99,44.25 85.6,44.25 85.6,8.94 62.99,8.94
V_BUCK on Top Layer: 10.16,26.85 31.5,26.85 31.5,13 10.16,13
V_BUCK on Bottom Layer: 10.16,26.85 31.5,26.85 31.5,13 10.16,13
VS on Top Layer: 20.11,40.31 37.72,40.31 37.72,22.4 20.11,22.4
VS on Bottom Layer: 20.11,40.31 37.72,40.31 37.72,22.4 20.11,22.4

## Text on the board
Top Silkscreen Layer: V_buck | GND | V_boost | + | - | 电流检测 | BUCK端 | BOOST端
